# Altium project SmartWatch.PrjPcb (part 1 of 2)
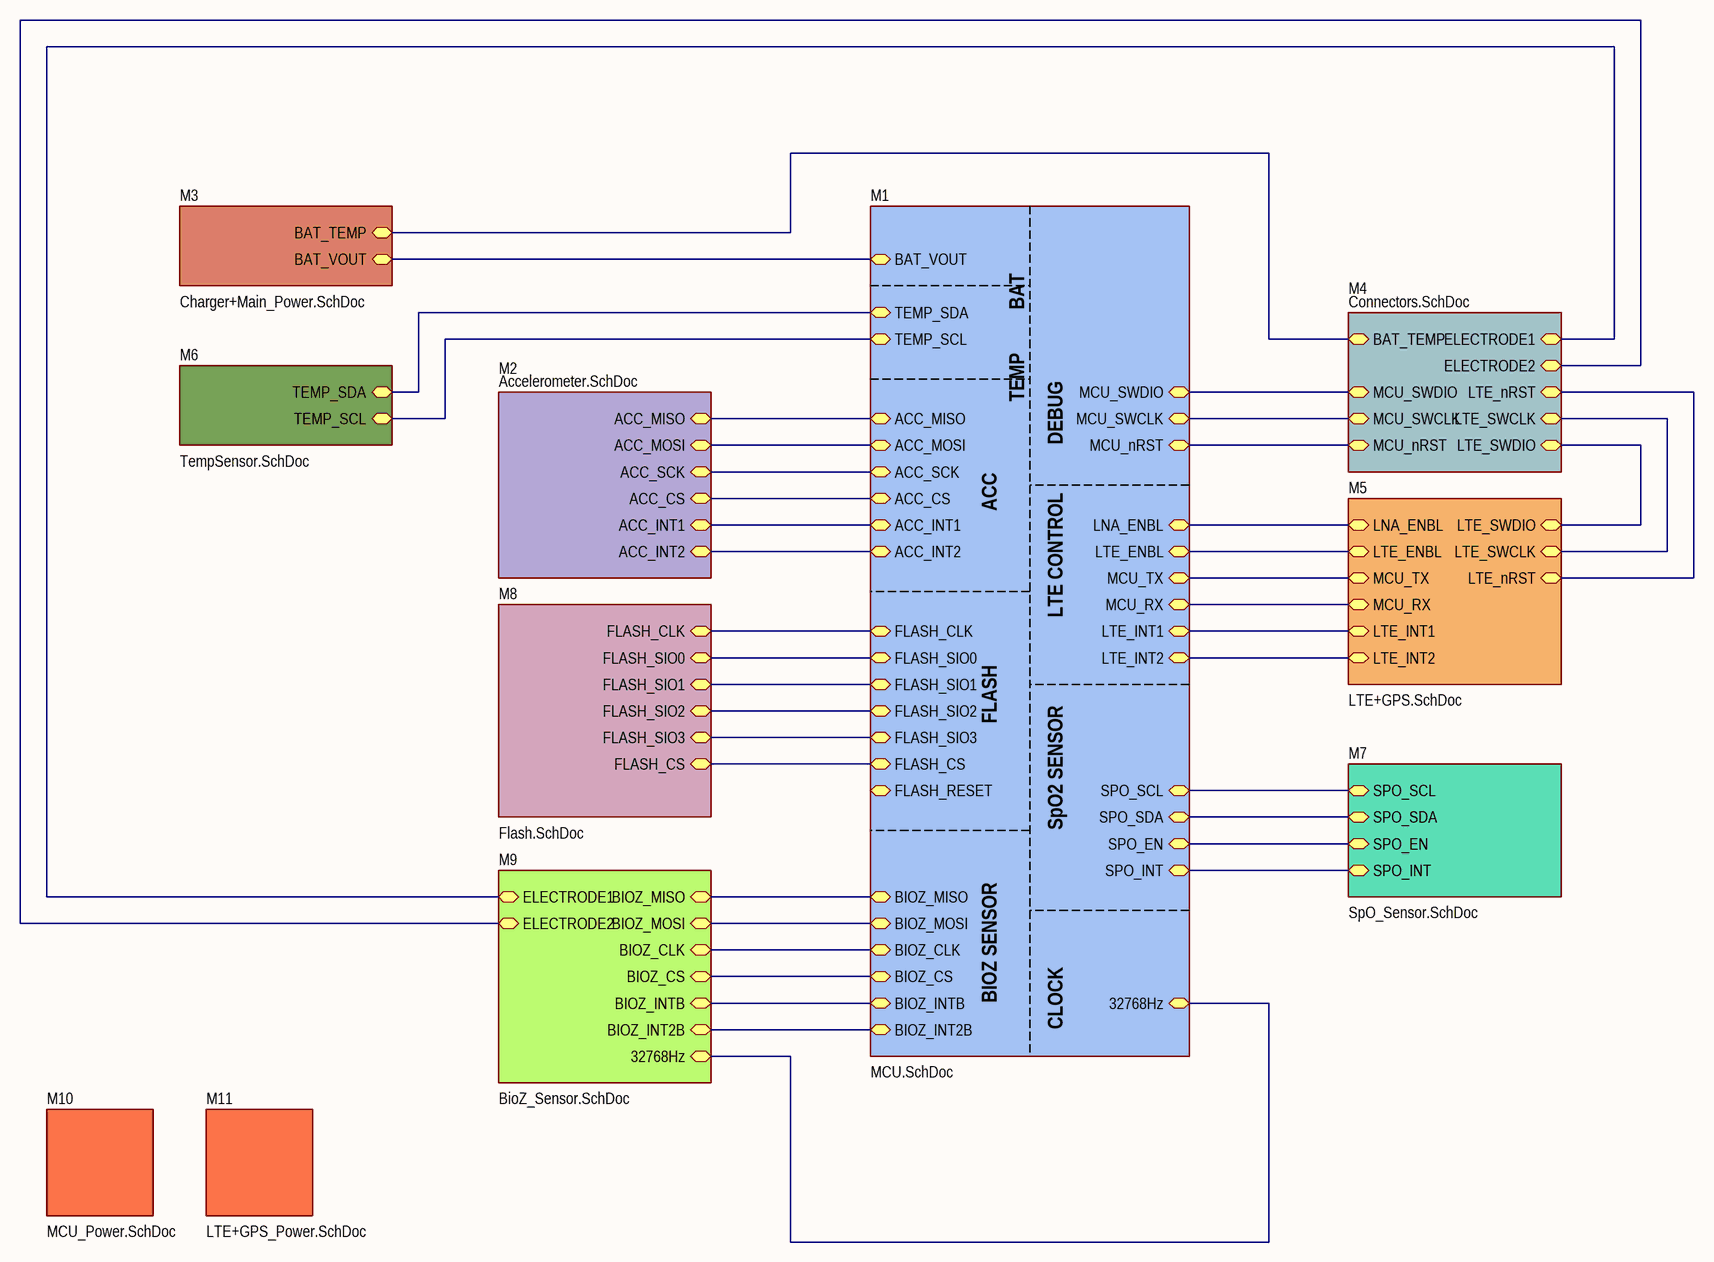
[diagram p0: Top_level.SchDoc]
12 sheets, 185 parts. Net scope: hierarchical (ports join the sheet entries above them; power ports are global).
Board file: SmartWatchPCB.PcbDoc
Sheets:
  Top_level.SchDoc
    M1 = MCU.SchDoc
    M2 = Accelerometer.SchDoc
    M3 = Charger+Main_Power.SchDoc
    M4 = Connectors.SchDoc
    M5 = LTE+GPS.SchDoc
    M8 = Flash.SchDoc
    M6 = TempSensor.SchDoc
    M7 = SpO_Sensor.SchDoc
    M9 = BioZ_Sensor.SchDoc
    M10 = MCU_Power.SchDoc
    M11 = LTE+GPS_Power.SchDoc

## Sheet Top_level.SchDoc
size 420 x 297 mm

### Sub-sheets
M1 = MCU.SchDoc: BAT_VOUT (bidir), TEMP_SDA (bidir), TEMP_SCL (bidir), ACC_INT2 (bidir), ACC_CS (bidir), LTE_ENBL (bidir), MCU_RX (bidir), ACC_MISO (bidir), ACC_MOSI (bidir), MCU_TX (bidir), MCU_nRST (bidir), MCU_SWCLK (bidir), MCU_SWDIO (bidir), ACC_INT1 (bidir), ACC_SCK (bidir), LNA_ENBL (bidir), FLASH_CS (bidir), FLASH_RESET (bidir), FLASH_SIO3 (bidir), FLASH_SIO0 (bidir), FLASH_CLK (bidir), FLASH_SIO2 (bidir), FLASH_SIO1 (bidir), 32768Hz (bidir), SPO_INT (bidir), SPO_EN (bidir), SPO_SCL (bidir), SPO_SDA (bidir), BIOZ_INT2B (bidir), BIOZ_INTB (bidir), BIOZ_MISO (bidir), BIOZ_CLK (bidir), BIOZ_MOSI (bidir), BIOZ_CS (bidir), LTE_INT1 (bidir), LTE_INT2 (bidir)
M2 = Accelerometer.SchDoc: ACC_MOSI (bidir), ACC_INT1 (bidir), ACC_CS (bidir), ACC_INT2 (bidir), ACC_SCK (bidir), ACC_MISO (bidir)
M3 = Charger+Main_Power.SchDoc: BAT_TEMP (bidir), BAT_VOUT (bidir)
M4 = Connectors.SchDoc: BAT_TEMP (bidir), MCU_SWDIO (bidir), MCU_nRST (bidir), MCU_SWCLK (bidir), ELECTRODE2 (bidir), ELECTRODE1 (bidir), LTE_SWDIO (bidir), LTE_nRST (bidir), LTE_SWCLK (bidir)
M5 = LTE+GPS.SchDoc: LNA_ENBL (bidir), LTE_ENBL (bidir), MCU_RX (bidir), MCU_TX (bidir), LTE_INT2 (bidir), LTE_INT1 (bidir), LTE_SWDIO (bidir), LTE_SWCLK (bidir), LTE_nRST (bidir)
M6 = TempSensor.SchDoc: TEMP_SCL (bidir), TEMP_SDA (bidir)
M7 = SpO_Sensor.SchDoc: SPO_SCL (bidir), SPO_INT (bidir), SPO_SDA (bidir), SPO_EN (bidir)
M8 = Flash.SchDoc: FLASH_CS (bidir), FLASH_SIO3 (bidir), FLASH_SIO0 (bidir), FLASH_CLK (bidir), FLASH_SIO2 (bidir), FLASH_SIO1 (bidir)
M9 = BioZ_Sensor.SchDoc: BIOZ_MISO (bidir), 32768Hz (bidir), BIOZ_CS (bidir), BIOZ_CLK (bidir), BIOZ_INTB (bidir), BIOZ_MOSI (bidir), ELECTRODE2 (bidir), ELECTRODE1 (bidir), BIOZ_INT2B (bidir)
M10 = MCU_Power.SchDoc: no entries
M11 = LTE+GPS_Power.SchDoc: no entries

### Nets
32768Hz: sheet M1/32768Hz, sheet M9/32768Hz
BAT_TS: sheet M3/BAT_TEMP, sheet M4/BAT_TEMP
NetC6_2: sheet M1/BAT_VOUT, sheet M3/BAT_VOUT
NetC11_2: sheet M1/MCU_nRST, sheet M4/MCU_nRST
NetC45_2: sheet M4/ELECTRODE1, sheet M9/ELECTRODE1
NetC52_2: sheet M4/ELECTRODE2, sheet M9/ELECTRODE2
NetD4_32: sheet M4/LTE_nRST, sheet M5/LTE_nRST
NetD4_33: sheet M4/LTE_SWCLK, sheet M5/LTE_SWCLK
NetD4_34: sheet M4/LTE_SWDIO, sheet M5/LTE_SWDIO
NetD7_A3: sheet M1/BIOZ_MISO, sheet M9/BIOZ_MISO
NetD7_B4: sheet M1/BIOZ_CLK, sheet M9/BIOZ_CLK
NetD7_B5: sheet M1/BIOZ_INT2B, sheet M9/BIOZ_INT2B
NetD7_C5: sheet M1/BIOZ_INTB, sheet M9/BIOZ_INTB
NetD7_C10: sheet M1/LTE_INT1, sheet M5/LTE_INT1
NetD7_D10: sheet M1/LTE_INT2, sheet M5/LTE_INT2
NetD7_E3: sheet M1/TEMP_SCL, sheet M6/TEMP_SCL
NetD7_E9: sheet M1/FLASH_CLK, sheet M8/FLASH_CLK
NetD7_E10: sheet M1/FLASH_SIO1, sheet M8/FLASH_SIO1
NetD7_F3: sheet M1/ACC_CS, sheet M2/ACC_CS
NetD7_F9: sheet M1/FLASH_SIO0, sheet M8/FLASH_SIO0
NetD7_F10: sheet M1/BIOZ_MOSI, sheet M9/BIOZ_MOSI
NetD7_G1: sheet M1/TEMP_SDA, sheet M6/TEMP_SDA
NetD7_G2: sheet M1/ACC_INT2, sheet M2/ACC_INT2
NetD7_G3: sheet M1/ACC_SCK, sheet M2/ACC_SCK
NetD7_G9: sheet M1/BIOZ_CS, sheet M9/BIOZ_CS
NetD7_G10: sheet M1/FLASH_SIO3, sheet M8/FLASH_SIO3
NetD7_H1: sheet M1/ACC_INT1, sheet M2/ACC_INT1
NetD7_H2: sheet M1/MCU_SWCLK, sheet M4/MCU_SWCLK
NetD7_H6: sheet M1/LTE_ENBL, sheet M5/LTE_ENBL
NetD7_H7: sheet M1/FLASH_CS, sheet M8/FLASH_CS
NetD7_H8: sheet M1/FLASH_SIO2, sheet M8/FLASH_SIO2
NetD7_J1: sheet M1/ACC_MOSI, sheet M2/ACC_MOSI
NetD7_J2: sheet M1/MCU_SWDIO, sheet M4/MCU_SWDIO
NetD7_J3: sheet M1/ACC_MISO, sheet M2/ACC_MISO
NetD7_J4: sheet M1/SPO_SCL, sheet M7/SPO_SCL
NetD7_J5: sheet M1/SPO_SDA, sheet M7/SPO_SDA
NetD7_J6: sheet M1/MCU_TX, sheet M5/MCU_TX
NetD7_K2: sheet M1/SPO_INT, sheet M7/SPO_INT
NetD7_K3: sheet M1/SPO_EN, sheet M7/SPO_EN
NetD7_K4: sheet M1/MCU_RX, sheet M5/MCU_RX
NetD7_K7: sheet M1/LNA_ENBL, sheet M5/LNA_ENBL

### Notes on the sheet
- BAT
- TEMP
- DEBUG
- ACC
- LTE CONTROL
- FLASH
- SpO2 SENSOR
- BIOZ SENSOR
- CLOCK
- Author
- Manufacturer
- Date
- Page
- Total pages
- Size page
- A3
- Materials

## Sheet MCU.SchDoc
size 420 x 297 mm
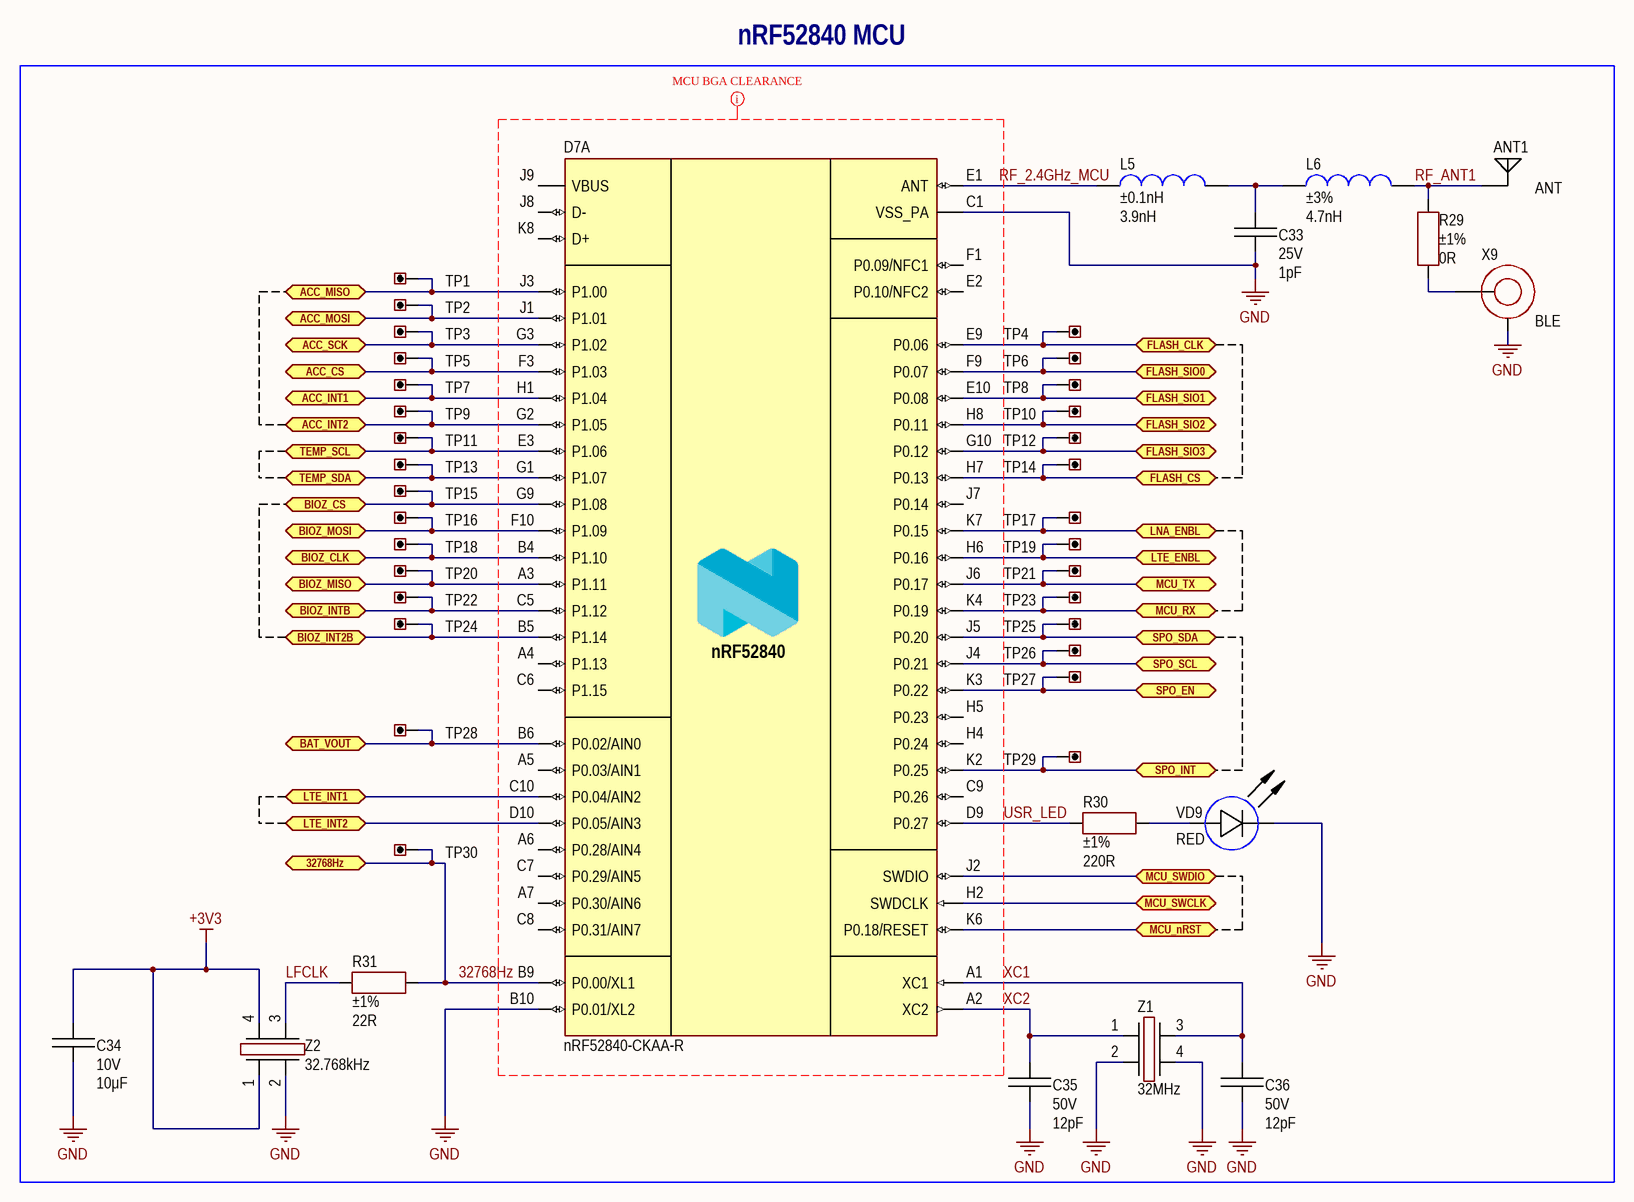
[diagram p1: MCU.SchDoc]

### Parts
ANT1  CommentText: ANT  [ANT: ANT2012LL00R2400A]
C33  value 1pF  Voltage: 25V  [CAP: 0201]
C34  value 10μF  Voltage: 10V  [CAP: 0805]
C35  value 12pF  Voltage: 50V  [CAP: 0805]
C36  value 12pF  Voltage: 50V  [CAP: 0805]
D7  PartNumber: nRF52840-CKAA-R  [MCU: nRF52840_WLCP93]  (part A of 2)
L5  value 3.9nH  Tolerance: ±0.1nH  [IND: 0201]
L6  value 4.7nH  Tolerance: ±3%  [IND: 0201]
R29  value 0R  Tolerance: ±1%  [RES: 0201]
R30  value 220R  Tolerance: ±1%  [RES: 0805]
R31  value 22R  Tolerance: ±1%  [RES: 0805]
TP1  (no value)  [CON: 5000 (Keystone)]
TP2  (no value)  [CON: 5000 (Keystone)]
TP3  (no value)  [CON: 5000 (Keystone)]
TP4  (no value)  [CON: 5000 (Keystone)]
TP5  (no value)  [CON: 5000 (Keystone)]
TP6  (no value)  [CON: 5000 (Keystone)]
TP7  (no value)  [CON: 5000 (Keystone)]
TP8  (no value)  [CON: 5000 (Keystone)]
TP9  (no value)  [CON: 5000 (Keystone)]
TP10  (no value)  [CON: 5000 (Keystone)]
TP11  (no value)  [CON: 5000 (Keystone)]
TP12  (no value)  [CON: 5000 (Keystone)]
TP13  (no value)  [CON: 5000 (Keystone)]
TP14  (no value)  [CON: 5000 (Keystone)]
TP15  (no value)  [CON: 5000 (Keystone)]
TP16  (no value)  [CON: 5000 (Keystone)]
TP17  (no value)  [CON: 5000 (Keystone)]
TP18  (no value)  [CON: 5000 (Keystone)]
TP19  (no value)  [CON: 5000 (Keystone)]
TP20  (no value)  [CON: 5000 (Keystone)]
TP21  (no value)  [CON: 5000 (Keystone)]
TP22  (no value)  [CON: 5000 (Keystone)]
TP23  (no value)  [CON: 5000 (Keystone)]
TP24  (no value)  [CON: 5000 (Keystone)]
TP25  (no value)  [CON: 5000 (Keystone)]
TP26  (no value)  [CON: 5000 (Keystone)]
TP27  (no value)  [CON: 5000 (Keystone)]
TP28  (no value)  [CON: 5000 (Keystone)]
TP29  (no value)  [CON: 5000 (Keystone)]
TP30  (no value)  [CON: 5000 (Keystone)]
VD9  Color: RED  [LED: 0805R]
X9  CommentText: BLE  [CON: u.Fl]
Z1  Frequency: 32MHz  [OSC: 2016]
Z2  Frequency: 32.768kHz  [OSC: 5032G]

### Blocks framed on the sheet
nRF52840 MCU: ANT1 C33-C36 D7 L5 L6 R29-R31 TP1-TP30 VD9 X9 Z1 Z2

### Ports
32768Hz (bidir), ACC_CS (bidir), ACC_INT1 (bidir), ACC_INT2 (bidir), ACC_MISO (bidir), ACC_MOSI (bidir), ACC_SCK (bidir), BAT_VOUT (bidir), BIOZ_CLK (bidir), BIOZ_CS (bidir), BIOZ_INT2B (bidir), BIOZ_INTB (bidir), BIOZ_MISO (bidir), BIOZ_MOSI (bidir), FLASH_CLK (bidir), FLASH_CS (bidir), FLASH_SIO0 (bidir), FLASH_SIO1 (bidir), FLASH_SIO2 (bidir), FLASH_SIO3 (bidir), LNA_ENBL (bidir), LTE_ENBL (bidir), LTE_INT1 (bidir), LTE_INT2 (bidir), MCU_nRST (bidir), MCU_RX (bidir), MCU_SWCLK (bidir), MCU_SWDIO (bidir), MCU_TX (bidir), SPO_EN (bidir), SPO_INT (bidir), SPO_SCL (bidir), SPO_SDA (bidir), TEMP_SCL (bidir), TEMP_SDA (bidir)

### Nets
+3V3: C34.2 Z2.1 Z2.4
GND: C33.1 C34.1 C35.1 C36.1 D7.B10(P0.01/XL2) D7.C1(VSS_PA) VD9.2(C) X9.2 Z1.2 Z1.4 Z2.2
32768Hz: D7.B9(P0.00/XL1) R31.1 TP30.1 ; port 32768Hz
LFCLK: R31.2 Z2.3
RF_2.4GHz_MCU: D7.E1(ANT) L5.2
RF_ANT1: ANT1.1 L6.1 R29.2
USR_LED: D7.D9(P0.27) R30.2
XC1: C36.2 D7.A1(XC1) Z1.3
XC2: C35.2 D7.A2(XC2) Z1.1
NetC6_2: D7.B6(P0.02/AIN0) TP28.1 ; port BAT_VOUT
NetC11_2: D7.K6(P0.18/RESET) ; port MCU_nRST
NetC33_2: C33.2 L5.1 L6.2
NetD7_A3: D7.A3(P1.11) TP20.1 ; port BIOZ_MISO
NetD7_B4: D7.B4(P1.10) TP18.1 ; port BIOZ_CLK
NetD7_B5: D7.B5(P1.14) TP24.1 ; port BIOZ_INT2B
NetD7_C5: D7.C5(P1.12) TP22.1 ; port BIOZ_INTB
NetD7_C10: D7.C10(P0.04/AIN2) ; port LTE_INT1
NetD7_D10: D7.D10(P0.05/AIN3) ; port LTE_INT2
NetD7_E3: D7.E3(P1.06) TP11.1 ; port TEMP_SCL
NetD7_E9: D7.E9(P0.06) TP4.1 ; port FLASH_CLK
NetD7_E10: D7.E10(P0.08) TP8.1 ; port FLASH_SIO1
NetD7_F3: D7.F3(P1.03) TP5.1 ; port ACC_CS
NetD7_F9: D7.F9(P0.07) TP6.1 ; port FLASH_SIO0
NetD7_F10: D7.F10(P1.09) TP16.1 ; port BIOZ_MOSI
NetD7_G1: D7.G1(P1.07) TP13.1 ; port TEMP_SDA
NetD7_G2: D7.G2(P1.05) TP9.1 ; port ACC_INT2
NetD7_G3: D7.G3(P1.02) TP3.1 ; port ACC_SCK
NetD7_G9: D7.G9(P1.08) TP15.1 ; port BIOZ_CS
NetD7_G10: D7.G10(P0.12) TP12.1 ; port FLASH_SIO3
NetD7_H1: D7.H1(P1.04) TP7.1 ; port ACC_INT1
NetD7_H2: D7.H2(SWDCLK) ; port MCU_SWCLK
NetD7_H6: D7.H6(P0.16) TP19.1 ; port LTE_ENBL
NetD7_H7: D7.H7(P0.13) TP14.1 ; port FLASH_CS
NetD7_H8: D7.H8(P0.11) TP10.1 ; port FLASH_SIO2
NetD7_J1: D7.J1(P1.01) TP2.1 ; port ACC_MOSI
NetD7_J2: D7.J2(SWDIO) ; port MCU_SWDIO
NetD7_J3: D7.J3(P1.00) TP1.1 ; port ACC_MISO
NetD7_J4: D7.J4(P0.21) TP26.1 ; port SPO_SCL
NetD7_J5: D7.J5(P0.20) TP25.1 ; port SPO_SDA
NetD7_J6: D7.J6(P0.17) TP21.1 ; port MCU_TX
NetD7_K2: D7.K2(P0.25) TP29.1 ; port SPO_INT
NetD7_K3: D7.K3(P0.22) TP27.1 ; port SPO_EN
NetD7_K4: D7.K4(P0.19) TP23.1 ; port MCU_RX
NetD7_K7: D7.K7(P0.15) TP17.1 ; port LNA_ENBL
NetR29_1: R29.1 X9.1
NetR30_1: R30.1 VD9.1(A)

Not connected (* = marked no-connect by the designer): D7 A4(P1.13) A5(P0.03/AIN1) A6(P0.28/AIN4) A7(P0.30/AIN6) C6(P1.15) C7(P0.29/AIN5) C8(P0.31/AIN7) C9(P0.26) E2(P0.10/NFC2) F1(P0.09/NFC1) H4(P0.24) H5(P0.23) J7(P0.14) J8(D-) J9(VBUS) K8(D+)

### Layout directives
net class MCU_BGA_CLEARANCE: RF_2.4GHz_MCU, USR_LED, XC1, XC2

### Notes on the sheet
- Author
- Manufacturer
- Date
- Page
- Total pages
- Size page
- A3
- Materials

### Library data of the parts
ANT1 = ANT2012LL00R2400A: 2.45GHz Bluetooth, ISM, Wi-Fi, Zigbee Chip RF Antenna 2.4GHz ~ 2.5GHz 3.77dBi Solder Surface Mount; Manufacturer: Yageo; ValueManufacturerPartNumber: Ceramic antenna, 2x1.25mm; HelpURL: https://www.digikey.com/en/products/detail/yageo/ANT2012LL00R2400A/9360375; Type: Ceramic antenna; PartNumber: ANT2012LL00R2400A; Package: 2x1.25mm
C33 = Ceramic_0201: 1 pF ±0.05pF 25V Ceramic Capacitor C0G, NP0 0201 (0603 Metric); Manufacturer: Murata Electronics; PartNumber: GJM0335C1E1R0WB01D; ValueManufacturerPartNumber: Ceramic capacitor, 1pF, NP0, ±0.05pF, 25V, 0201, -55...+125°C; Package: 0201; HelpURL: https://www.digikey.com/en/products/detail/murata-electronics/GJM0335C1E1R0WB01D/2592505; Temperature: -55...+125°C; TypeCapacitor: Ceramic capacitor; Tolerance: ±0.05pF; TypeDielectric: NP0
C34 = Ceramic_0805: 10 µF ±10% 10V Ceramic Capacitor X7R 0805 (2012 Metric); Manufacturer: Yageo; PartNumber: CC0805KFX7R6BB106; ValueManufacturerPartNumber: Ceramic capacitor, 10μF, X7R, ±10%, 10V, 0805, -55...+125°C; Package: 0805; HelpURL: https://www.digikey.com/en/products/detail/yageo/CC0805KFX7R6BB106/11611326; Temperature: -55...+125°C; TypeCapacitor: Ceramic capacitor; Tolerance: ±10%; TypeDielectric: X7R
C35 C36 = Ceramic_0805: 12 pF ±1% 50V Ceramic Capacitor C0G, NP0 0805 (2012 Metric); Manufacturer: Yageo; PartNumber: CC0805FRNPO9BN120; ValueManufacturerPartNumber: Ceramic capacitor, 12pF, NP0, ±10%, 50V, 0805, -55...+125°C; Tolerance: ±10%; Package: 0805; HelpURL: https://www.digikey.com/en/products/detail/yageo/CC0805FRNPO9BN120/5883925; Temperature: -55...+125°C; TypeCapacitor: Ceramic capacitor; TypeDielectric: NP0
D7 = nRF52840: MCU; Manufacturer: Nordic Semiconductor; CoreSize: 32bit; Speed: 64 MHz; MemoryROM: 1 MB; CoreProcessor: Cortex-M4; MemoryRAM: 256 kB; HelpURL: https://www.mouser.com/ProductDetail/Nordic-Semiconductor/nRF52840-CKAA-R?qs=PqoDHHvF64%2FDLCQsJ11t5w%3D%3D; ComponentType: IC microcontroller; Package: 93-WLCSP; ValueManufacturerPartNumber: =ComponentType+', '+CoreSize+', '+CoreProcessor+', '+Speed+', '+MemoryROM+', '+MemoryRAM+', '+Supply+', '+Temperature+', '+Package
L5 = Inductor_0201: 3.9 nH Unshielded Thick Film Inductor 400 mA 300mOhm Max 0201 (0603 Metric); Manufacturer: Murata Electronics; PartNumber: LQP03TN3N9B02D; ValueManufacturerPartNumber: Fixed inductor, 3.9nH, ±0.1nH, 0201, 400mA, -55...+125°C; TypeInductor: Fixed inductor; MaxCurrent: 400mA; Package: 0201; HelpURL: https://www.digikey.com/en/products/detail/murata-electronics/LQP03TN3N9B02D/2391748; Temperature: -55...+125°C
L6 = Inductor_0201: 4.7 nH Unshielded Thick Film Inductor 350 mA 400mOhm Max 0201 (0603 Metric); Manufacturer: Murata Electronics; PartNumber: LQP03TN4N7H02D; ValueManufacturerPartNumber: Fixed inductor, 4.7nH, ±3%, 0201, 350mA, -55...+125°C; TypeInductor: Fixed inductor; MaxCurrent: 350mA; Package: 0201; HelpURL: https://www.digikey.com/en/products/detail/murata-electronics/LQP03TN4N7H02D/4358101; Temperature: -55...+125°C
R29 = Resistor_0201: 0 Ohms Jumper 0.05W, 1/20W Chip Resistor 0201 (0603 Metric) Moisture Resistant Thick Film; Manufacturer: Yageo; PartNumber: RC0201FR-070RL; ValueManufacturerPartNumber: Resistor film, 0R, ±1%, 0201, 0.05W, -55...+125°C; TypeResistor: Resistor film; Package: 0201; HelpURL: https://www.digikey.com/en/products/detail/yageo/RC0201FR-070RL/1948858; Temperature: -55...+125°C; Power: 0.05W
R30 = Resistor_0805: 22 Ohms ±1% 0.125W, 1/8W Chip Resistor 0805 (2012 Metric) Moisture Resistant Thick Film; Manufacturer: Yageo; PartNumber: RC0805JR-07220RL; ValueManufacturerPartNumber: Resistor film, 220R, ±1%, 0805, 0.125W, -55...+125°C; TypeResistor: Resistor film; Package: 0805; HelpURL: https://www.digikey.com/en/products/detail/yageo/RC0805JR-07220RL/728283; Temperature: -55...+125°C; Power: 0.125W
R31 = Resistor_0805: 22 Ohms ±1% 0.125W, 1/8W Chip Resistor 0805 (2012 Metric) Moisture Resistant Thick Film; Manufacturer: Yageo; PartNumber: RC0805FR-0722RL; ValueManufacturerPartNumber: Resistor film, 22R, ±1%, 0805, 0.125W, -55...+125°C; TypeResistor: Resistor film; Package: 0805; HelpURL: https://www.digikey.com/en/products/detail/yageo/RC0805FR-0722RL/727735; Temperature: -55...+125°C; Power: 0.125W
TP1-TP30 = Connector_Test_Point: Red PC Test Point, Miniature Phosphor Bronze Silver Plating 0.040" (1.02mm) Hole Diameter Mounting Type; Manufacturer: Keystone; ValueManufacturerPartNumber: Test point, Keystone, 5000; PartNumber: 5000; HelpURL: https://www.digikey.com/en/products/detail/keystone-electronics/5000/255326; TypeConnector: Test point
VD9 = LED_single: Red 625nm LED Indication - Discrete 1.8V 0805 (2012 Metric); Manufacturer: Kingbright; ValueManufacturerPartNumber: LED, RED, 30mA, 1.8V, 0805, -55...+150°C; PartNumber: APT2012LSECK/J3-PRV; Current: 30mA; Package: 0805; HelpURL: https://www.digikey.com/en/products/detail/kingbright/APT2012LSECK-J3-PRV/5177436; Temperature: -55...+150°C; TypeDiode: LED; VoltageDrop: 1.8V; ColorParameter: RED
X9 = Connector_uFL: U.FL (UMCC) Connector Receptacle, Male Pin 50Ohm Surface Mount Solder; Manufacturer: Hirose Electric; ValueManufacturerPartNumber: Connector u.FL, 50 Ohm, 6GHz; PartNumber: U.FL-R-SMT(01); TypeConnector: Connector u.FL; Frequency: 6GHz; HelpURL: https://www.digikey.com/product-detail/en/hirose-electric-co-ltd/U.FL-R-SMT-01/H9161-ND/513010; Impedance: 50 Ohm
Z1 = Crystal_2016: 32 MHz ±10ppm Crystal 8pF 60 Ohms 4-SMD, No Lead; Manufacturer: EPSON; PartNumber: FA-128 32.0000MF10Z-AJ3; ValueManufacturerPartNumber: Crystal, 32MHz, 8pF, ±50ppm, case 2016, -30...+85°C; Tolerance: ±50ppm; Package: case 2016; HelpURL: https://www.digikey.com/en/products/detail/epson/FA-128-32-0000MF10Z-AJ3/5259651; Temperature: -30...+85°C; TypeOscilator: Crystal; LoadCapacitance: 8pF
Z2 = Oscilator_5032: 32.768 kHz XO (Standard) LVCMOS Oscillator 1.8V Enable/Disable 4-SMD, No Lead; Manufacturer: Abracon LLC; PartNumber: KD3270037; ValueManufacturerPartNumber: Oscilator, 32.768kHz, HCMOS, ±50ppm, case 5032, -20...+70°C; LoadCapacitance: HCMOS; Tolerance: ±50ppm; Package: case 5032; HelpURL: https://www.digikey.com/en/products/detail/diodes-incorporated/KD3270037/2833169; Temperature: -20...+70°C; TypeOscilator: Oscilator

## Sheet Accelerometer.SchDoc
size 420 x 297 mm
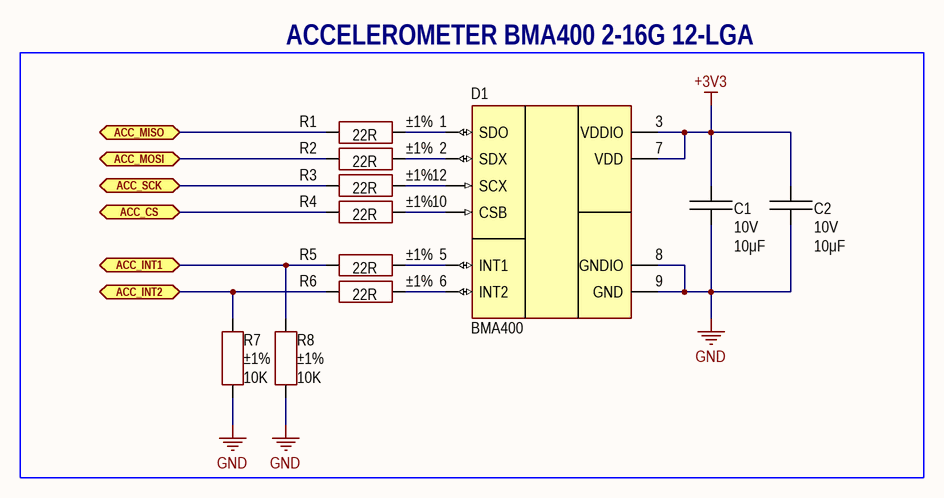
[diagram p2: Accelerometer.SchDoc]

### Parts
C1  value 10μF  Voltage: 10V  [CAP: 0805]
C2  value 10μF  Voltage: 10V  [CAP: 0805]
D1  (no value)  [12-VFLGA]
R1  value 22R  Tolerance: ±1%  [RES: 0805]
R2  value 22R  Tolerance: ±1%  [RES: 0805]
R3  value 22R  Tolerance: ±1%  [RES: 0805]
R4  value 22R  Tolerance: ±1%  [RES: 0805]
R5  value 22R  Tolerance: ±1%  [RES: 0805]
R6  value 22R  Tolerance: ±1%  [RES: 0805]
R7  value 10K  Tolerance: ±1%  [RES: 0805]
R8  value 10K  Tolerance: ±1%  [RES: 0805]

### Blocks framed on the sheet
ACCELEROMETER BMA400 2-16G 12-LGA: C1 C2 D1 R1-R8

### Ports
ACC_CS (bidir), ACC_INT1 (bidir), ACC_INT2 (bidir), ACC_MISO (bidir), ACC_MOSI (bidir), ACC_SCK (bidir)

### Nets
+3V3: C1.2 C2.2 D1.3(VDDIO) D1.7(VDD)
GND: C1.1 C2.1 D1.8(GNDIO) D1.9(GND) R7.1 R8.1
NetD1_1: D1.1(SDO) R1.2
NetD1_2: D1.2(SDX) R2.2
NetD1_5: D1.5(INT1) R5.2
NetD1_6: D1.6(INT2) R6.2
NetD1_10: D1.10(CSB) R4.2
NetD1_12: D1.12(SCX) R3.2
NetD7_F3: R4.1 ; port ACC_CS
NetD7_G2: R6.1 R7.2 ; port ACC_INT2
NetD7_G3: R3.1 ; port ACC_SCK
NetD7_H1: R5.1 R8.2 ; port ACC_INT1
NetD7_J1: R2.1 ; port ACC_MOSI
NetD7_J3: R1.1 ; port ACC_MISO

### Notes on the sheet
- Author
- Manufacturer
- Date
- Page
- Total pages
- Size page
- A3
- Materials

### Library data of the parts
C1 C2 = Ceramic_0805: as C34 on sheet MCU; Package: 0805; HelpURL: https://www.digikey.com/en/products/detail/yageo/CC0805KFX7R6BB106/11611326; Temperature: -55...+125°C; TypeCapacitor: Ceramic capacitor; Tolerance: ±10%; TypeDielectric: X7R
D1 = BMA400: Accelerometer; Manufacturer: Bosch Sensortec; Supply: 1.72...3.6V; Sensing: Digital sensor; HelpURL: https://www.digikey.com/en/products/detail/bosch-sensortec/BMA400/8634941; Package: 12-VFLGA; ComponentType: IC accelerometer; ValueManufacturerPartNumber: =ComponentType+', '+Sensing+', '+Accuracy+', '+GainBandwidth+', '+Sensitivity+', '+Temperature+', '+Package; Temperature: -40...+85°C; PartNumber: BMA400
R1-R6 = Resistor_0805: as R31 on sheet MCU; Package: 0805; HelpURL: https://www.digikey.com/en/products/detail/yageo/RC0805FR-0722RL/727735; Temperature: -55...+125°C; Power: 0.125W
R7 R8 = Resistor_0805: 10 kOhms ±1% 0.125W, 1/8W Chip Resistor 0805 (2012 Metric) Moisture Resistant Thick Film; Manufacturer: Yageo; PartNumber: RC0805FR-0710KL; ValueManufacturerPartNumber: Resistor film, 10K, ±1%, 0805, 0.125W, -55...+125°C; TypeResistor: Resistor film; Package: 0805; HelpURL: https://www.digikey.com/en/products/detail/yageo/RC0805FR-0710KL/727535; Temperature: -55...+125°C; Power: 0.125W

## Sheet Charger+Main_Power.SchDoc
size 420 x 297 mm
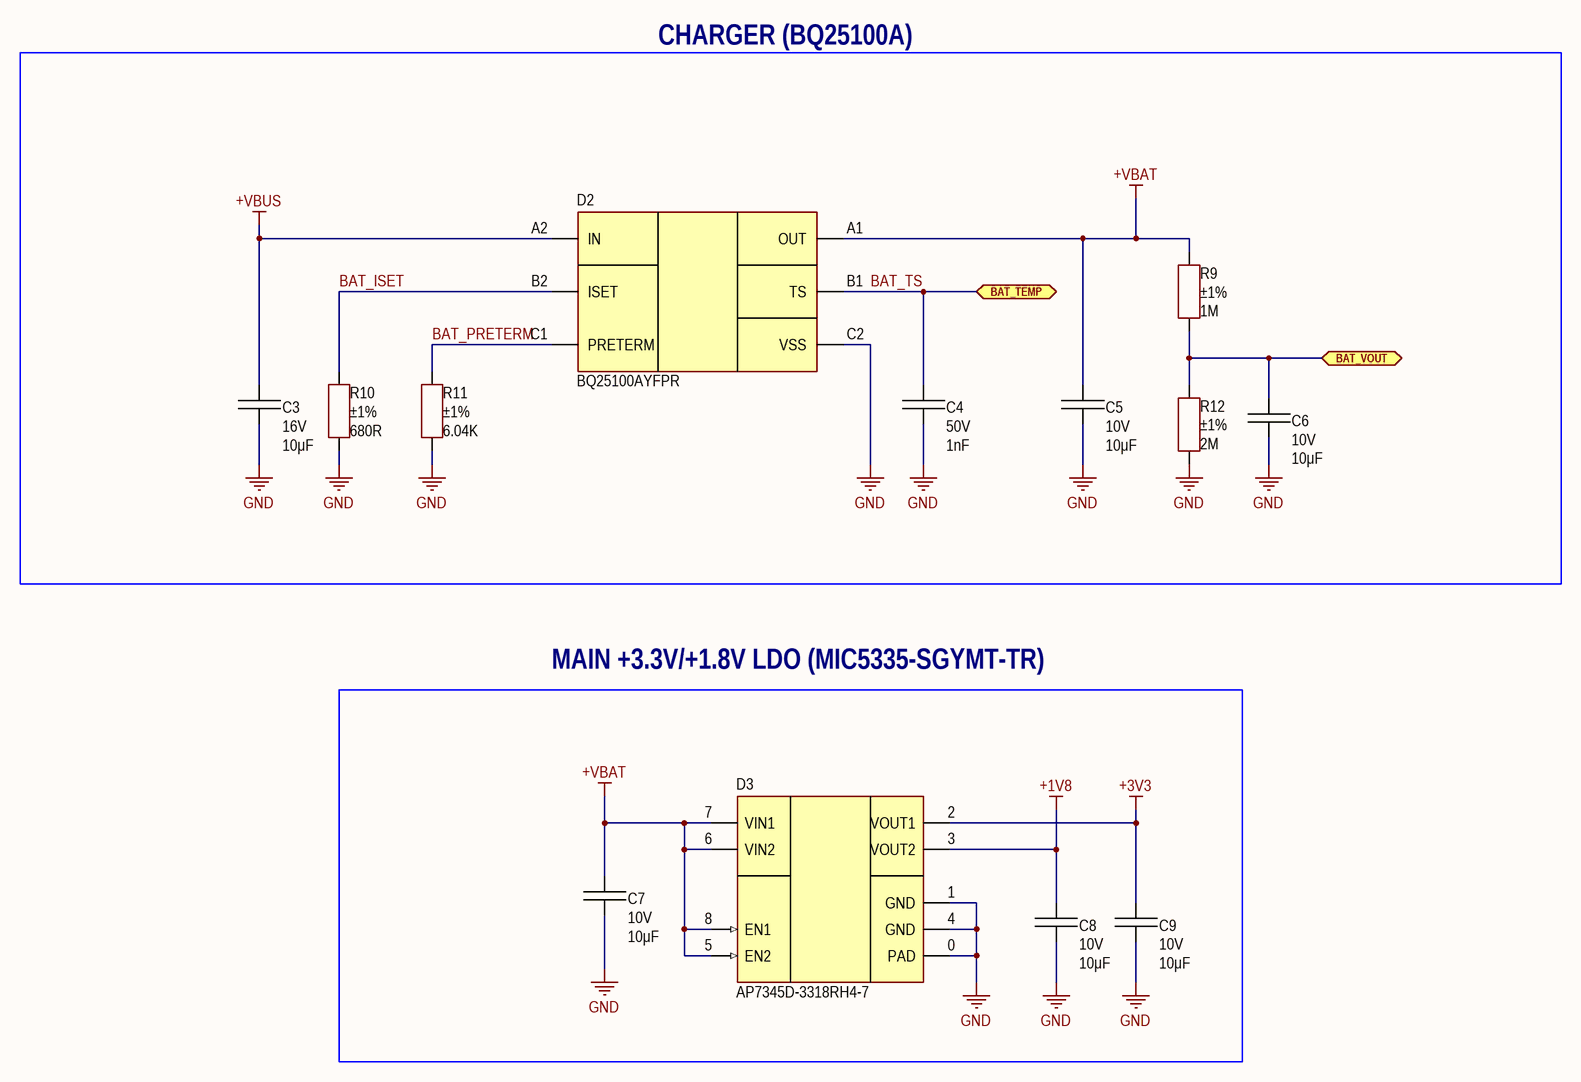
[diagram p3: Charger+Main_Power.SchDoc]

### Parts
C3  value 10μF  Voltage: 16V  [CAP: 0805]
C4  value 1nF  Voltage: 50V  [CAP: 0805]
C5  value 10μF  Voltage: 10V  [CAP: 0805]
C6  value 10μF  Voltage: 10V  [CAP: 0805]
C7  value 10μF  Voltage: 10V  [CAP: 0805]
C8  value 10μF  Voltage: 10V  [CAP: 0805]
C9  value 10μF  Voltage: 10V  [CAP: 0805]
D2  (no value)  [IC: BQ25100]
D3  (no value)  [IC: 8-XFDFN]
R9  value 1M  Tolerance: ±1%  [RES: 0805]
R10  value 680R  Tolerance: ±1%  [RES: 0805]
R11  value 6.04K  Tolerance: ±1%  [RES: 0805]
R12  value 2M  Tolerance: ±1%  [RES: 0805]

### Blocks framed on the sheet
CHARGER (BQ25100A): C3-C6 D2 R9-R12
MAIN +3.3V/+1.8V LDO (MIC5335-SGYMT-TR): C7-C9 D3

### Ports
BAT_TEMP (bidir), BAT_VOUT (bidir)

### Nets
+1V8: C8.2 D3.3(VOUT2)
+3V3: C9.2 D3.2(VOUT1)
+VBAT: C5.2 C7.2 D2.A1(OUT) D3.5(EN2) D3.6(VIN2) D3.7(VIN1) D3.8(EN1) R9.1
+VBUS: C3.2 D2.A2(IN)
GND: C3.1 C4.1 C5.1 C6.1 C7.1 C8.1 C9.1 D2.C2(VSS) D3.0(PAD) D3.1(GND) D3.4(GND) R10.2 R11.2 R12.2
BAT_ISET: D2.B2(ISET) R10.1
BAT_PRETERM: D2.C1(PRETERM) R11.1
BAT_TS: C4.2 D2.B1(TS) ; port BAT_TEMP
NetC6_2: C6.2 R9.2 R12.1 ; port BAT_VOUT

### Notes on the sheet
- Author
- Manufacturer
- Date
- Page
- Total pages
- Size page
- A3
- Materials

### Library data of the parts
C3 = Ceramic_0805: 10 µF ±20% 16V Ceramic Capacitor X7R 0805 (2012 Metric); Manufacturer: Yageo; PartNumber: CC0805MKX7R7BB106; ValueManufacturerPartNumber: Ceramic capacitor, 10μF, X7R, ±10%, 16V, 0805, -55...+125°C; Tolerance: ±10%; Package: 0805; HelpURL: https://www.digikey.com/en/products/detail/yageo/CC0805MKX7R7BB106/7164392; Temperature: -55...+125°C; TypeCapacitor: Ceramic capacitor; TypeDielectric: X7R
C4 = Ceramic_0805: 1000 pF ±5% 50V Ceramic Capacitor C0G, NP0 0805 (2012 Metric); Manufacturer: Yageo; PartNumber: CC0805JRNPO9BN102; ValueManufacturerPartNumber: Ceramic capacitor, 1nF, NP0, ±5%, 50V, 0805, -55...+125°C; Package: 0805; HelpURL: https://www.digikey.com/en/products/detail/yageo/CC0805JRNPO9BN102/302856; Temperature: -55...+125°C; TypeCapacitor: Ceramic capacitor; Tolerance: ±5%; TypeDielectric: NP0
C5-C9 = Ceramic_0805: as C34 on sheet MCU; Package: 0805; HelpURL: https://www.digikey.com/en/products/detail/yageo/CC0805KFX7R6BB106/11611326; Temperature: -55...+125°C; TypeCapacitor: Ceramic capacitor; Tolerance: ±10%; TypeDielectric: X7R
D2 = BQ25100AYFPR: PMIC; Manufacturer: Texas Instruments; ValueManufacturerPartNumber: PMIC, Li-Ion/Li-Po, 4.45...6.45V, -40...+85°C, 10-WSON; Supply: 4.45...6.45V; HelpURL: https://www.digikey.com/en/products/detail/texas-instruments/BQ25100AYFPR/4977096; Package: 10-WSON; ComponentType: PMIC; Temperature: -40...+85°C; Standard: Li-Ion/Li-Po; PartNumber: BQ25100AYFPR
D3 = AP7345D-3318RH4-7: Linear voltage regulator; Manufacturer: Diodes Incorporated; ValueManufacturerPartNumber: Linear voltage regulator, input 3.6...5.25V, 0.39V, 3.3V/1.8V, 0.3A, -40...+125°C, 8-XFDFN; VoltageInput: input 3.6...5.25V; MaxDropout: 0.39V; CurrentOutput: 0.3A; VoltageOutput: 3.3V/1.8V; HelpURL: https://www.digikey.com/en/products/detail/diodes-incorporated/AP7345D-3318RH4-7/9857637; Package: 8-XFDFN; ComponentType: Linear voltage regulator; Temperature: -40...+125°C; PartNumber: AP7345D-3318RH4-7
R9 = Resistor_0805: 1 MOhms ±1% 0.125W, 1/8W Chip Resistor 0805 (2012 Metric) Moisture Resistant Thick Film; Manufacturer: Yageo; PartNumber: RC0805FR-071ML; ValueManufacturerPartNumber: Resistor film, 1M, ±1%, 0805, 0.125W, -55...+125°C; TypeResistor: Resistor film; Package: 0805; HelpURL: https://www.digikey.com/en/products/detail/yageo/RC0805FR-071ML/727445; Temperature: -55...+125°C; Power: 0.125W
R10 = Resistor_0805: 680 Ohms ±1% 0.125W, 1/8W Chip Resistor 0805 (2012 Metric) Moisture Resistant Thick Film; Manufacturer: Yageo; PartNumber: RC0805FR-07680RL; ValueManufacturerPartNumber: Resistor film, 680R, ±1%, 0805, 0.125W, -55...+125°C; TypeResistor: Resistor film; Package: 0805; HelpURL: https://www.digikey.com/en/products/detail/yageo/RC0805FR-07680RL/728101; Temperature: -55...+125°C; Power: 0.125W
R11 = Resistor_0805: 6.04 kOhms ±1% 0.125W, 1/8W Chip Resistor 0805 (2012 Metric) Moisture Resistant Thick Film; Manufacturer: Yageo; PartNumber: RC0805FR-076K04L; ValueManufacturerPartNumber: Resistor film, 6.04K, ±1%, 0805, 0.125W, -55...+125°C; TypeResistor: Resistor film; Package: 0805; HelpURL: https://www.digikey.com/en/products/detail/yageo/RC0805FR-076K04L/728049; Temperature: -55...+125°C; Power: 0.125W
R12 = Resistor_0805: 2 MOhms ±1% 0.125W, 1/8W Chip Resistor 0805 (2012 Metric) Moisture Resistant Thick Film; Manufacturer: Yageo; PartNumber: RC0805FR-072ML; ValueManufacturerPartNumber: Resistor film, 2M, ±1%, 0805, 0.125W, -55...+125°C; TypeResistor: Resistor film; Package: 0805; HelpURL: https://www.digikey.com/en/products/detail/yageo/RC0805FR-072ML/727665; Temperature: -55...+125°C; Power: 0.125W

## Sheet Connectors.SchDoc
size 420 x 297 mm
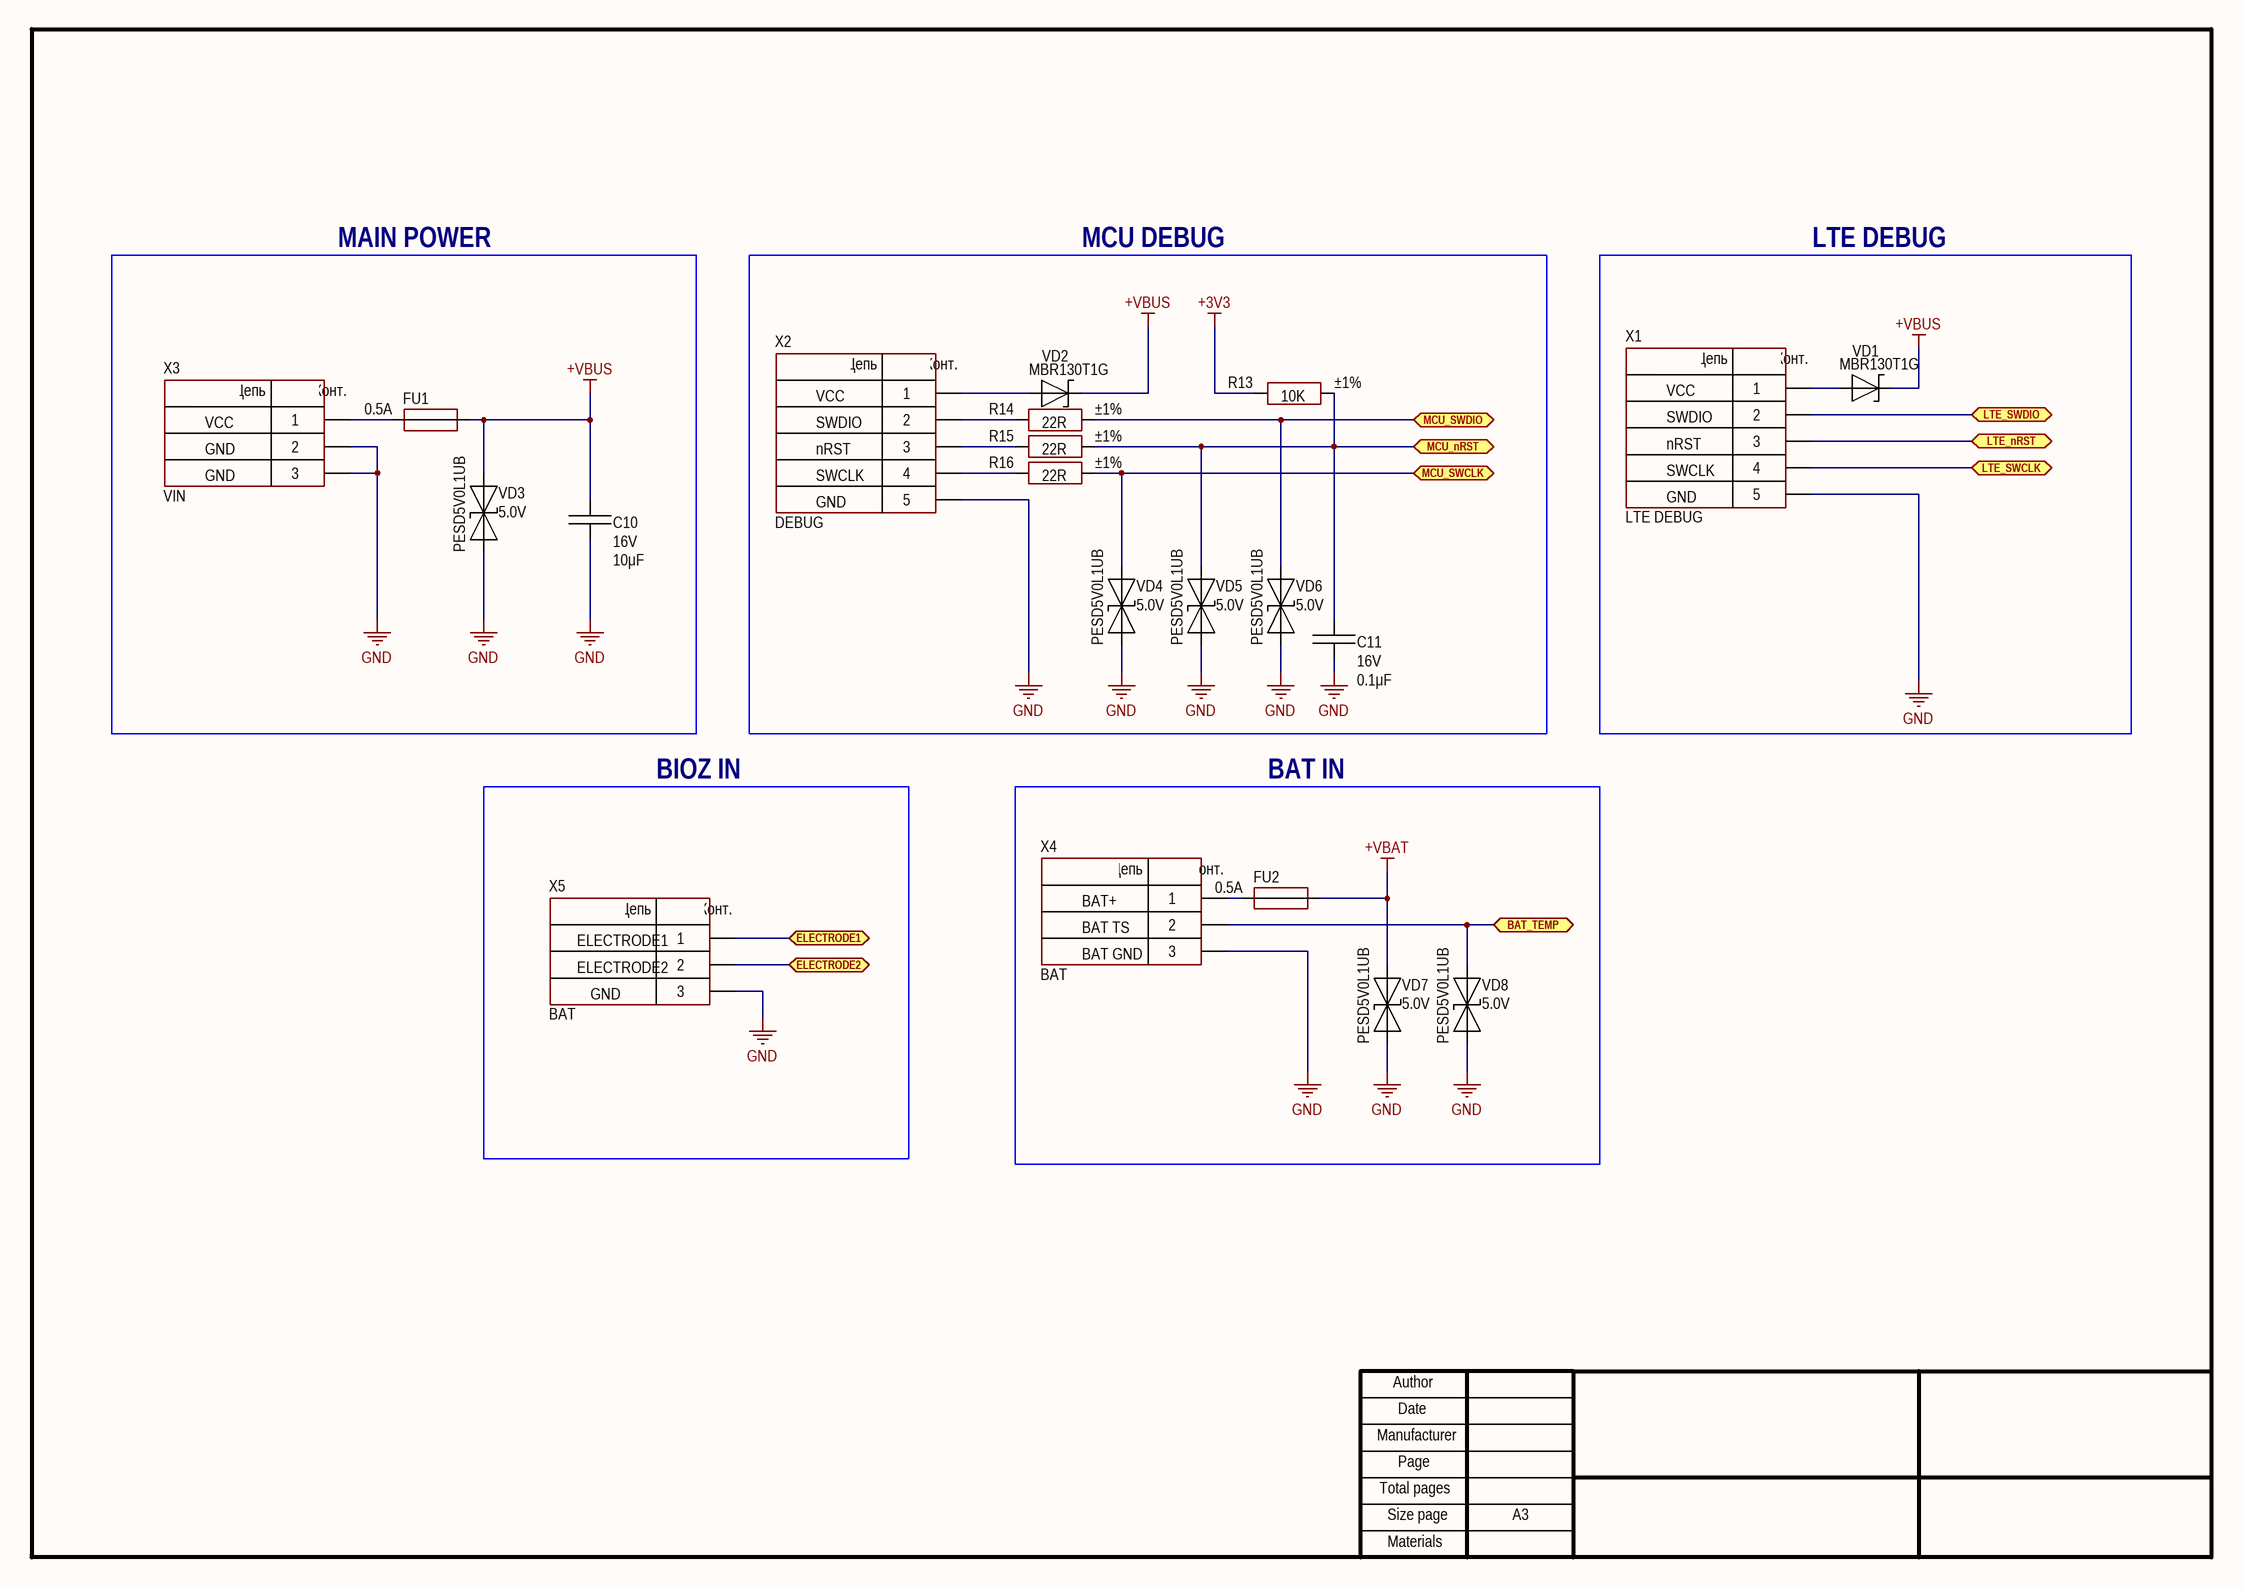
[diagram p4: Connectors.SchDoc]

### Parts
C10  value 10μF  Voltage: 16V  [CAP: 0805]
C11  value 0.1μF  Voltage: 16V  [CAP: 0805]
FU1  MaxCurrent: 0.5A  [FUSE: 1206]
FU2  MaxCurrent: 0.5A  [FUSE: 1206]
R13  value 10K  Tolerance: ±1%  [RES: 0805]
R14  value 22R  Tolerance: ±1%  [RES: 0805]
R15  value 22R  Tolerance: ±1%  [RES: 0805]
R16  value 22R  Tolerance: ±1%  [RES: 0805]
VD1  PartNumber: MBR130T1G  [DIODE: SOD123]
VD2  PartNumber: MBR130T1G  [DIODE: SOD123]
VD3  Voltage: 5.0V  PartNumber: PESD5V0L1UB  [DIODE: SOD523]
VD4  Voltage: 5.0V  PartNumber: PESD5V0L1UB  [DIODE: SOD523]
VD5  Voltage: 5.0V  PartNumber: PESD5V0L1UB  [DIODE: SOD523]
VD6  Voltage: 5.0V  PartNumber: PESD5V0L1UB  [DIODE: SOD523]
VD7  Voltage: 5.0V  PartNumber: PESD5V0L1UB  [DIODE: SOD523]
VD8  Voltage: 5.0V  PartNumber: PESD5V0L1UB  [DIODE: SOD523]
X1  CommentText: LTE DEBUG  [CON: PLS-5]
X2  CommentText: DEBUG  [CON: PLS-5]
X3  CommentText: VIN  [CON: DG350-3.5-03P]
X4  CommentText: BAT  [CON: DG350-3.5-03P]
X5  CommentText: BAT  [CON: DG350-3.5-03P]

### Blocks framed on the sheet
MAIN POWER: C10 FU1 VD3 X3
MCU DEBUG: C11 R13-R16 VD2 VD4-VD6 X2
LTE DEBUG: VD1 X1
BIOZ IN: X5
BAT IN: FU2 VD7 VD8 X4

### Ports
BAT_TEMP (bidir), ELECTRODE1 (bidir), ELECTRODE2 (bidir), LTE_nRST (bidir), LTE_SWCLK (bidir), LTE_SWDIO (bidir), MCU_nRST (bidir), MCU_SWCLK (bidir), MCU_SWDIO (bidir)

### Nets
+3V3: R13.1
+VBAT: FU2.2 VD7.2(C)
+VBUS: C10.2 FU1.2 VD1.2 VD2.2 VD3.2(C)
GND: C10.1 C11.1 VD3.1(A) VD4.1(A) VD5.1(A) VD6.1(A) VD7.1(A) VD8.1(A) X1.5 X2.5 X3.2 X3.3 X4.3 X5.3
BAT_TS: VD8.2(C) X4.2 ; port BAT_TEMP
NetC11_2: C11.2 R13.2 R15.2 VD5.2(C) ; port MCU_nRST
NetC45_2: X5.1 ; port ELECTRODE1
NetC52_2: X5.2 ; port ELECTRODE2
NetD4_32: X1.3 ; port LTE_nRST
NetD4_33: X1.4 ; port LTE_SWCLK
NetD4_34: X1.2 ; port LTE_SWDIO
NetD7_H2: R16.2 VD4.2(C) ; port MCU_SWCLK
NetD7_J2: R14.2 VD6.2(C) ; port MCU_SWDIO
NetFU1_1: FU1.1 X3.1
NetFU2_1: FU2.1 X4.1
NetR14_1: R14.1 X2.2
NetR15_1: R15.1 X2.3
NetR16_1: R16.1 X2.4
NetVD1_1: VD1.1 X1.1
NetVD2_1: VD2.1 X2.1

### Notes on the sheet
- VCC
- GND
- nRST
- SWDIO
- SWCLK
- BAT+
- BAT TS
- (near X5) ELECTRODE1
- (near X5) ELECTRODE2
- BAT GND
- Author
- Manufacturer
- Date
- Page
- Total pages
- Size page
- A3
- Materials
- (in symbol Connector_terminal_3pin) Цепь; Конт.
- (in symbol PLS-5) Цепь; Конт.

### Library data of the parts
C10 = Ceramic_0805: as C3 on sheet Charger+Main_Power; Package: 0805; HelpURL: https://www.digikey.com/en/products/detail/yageo/CC0805MKX7R7BB106/7164392; Temperature: -55...+125°C; TypeCapacitor: Ceramic capacitor; TypeDielectric: X7R
C11 = Ceramic_0805: Manufacturer: Yageo; PartNumber: CC0805KRX7R7BB104; ValueManufacturerPartNumber: Ceramic capacitor, 0.1μF, X7R, ±10%, 16V, 0805, -55...+125°C; TypeCapacitor: Ceramic capacitor; Tolerance: ±10%; TypeDielectric: X7R; Package: 0805; HelpURL: https://www.digikey.com/product-detail/en/yageo/CC0805KRX7R7BB104/311-1142-1-ND/303052; Temperature: -55...+125°C
FU1 FU2 = Fuse: Polymeric PTC Resettable Fuse 6V 500 mA Ih Surface Mount 0805 (2012 Metric), Concave; Manufacturer: Bel Fuse; PartNumber: 0ZCK0050FF2E; TypeFuse: Electromechanics relay; VoltageMax: 250VAC; Package: 1206; HelpURL: https://www.digikey.com/en/products/detail/bel-fuse-inc/0ZCK0050FF2E/4156141; ValueManufacturerPartNumber: =TypeFuse+', '+VoltageMax+', '+MaxCurrent+', '+Package+', '+Temperature
R13 = Resistor_0805: as R7 on sheet Accelerometer; Package: 0805; HelpURL: https://www.digikey.com/en/products/detail/yageo/RC0805FR-0710KL/727535; Temperature: -55...+125°C; Power: 0.125W
R14-R16 = Resistor_0805: as R31 on sheet MCU; Package: 0805; HelpURL: https://www.digikey.com/en/products/detail/yageo/RC0805FR-0722RL/727735; Temperature: -55...+125°C; Power: 0.125W
VD1 VD2 = Schottky_single: Diode Schottky 30 V 1A Surface Mount SOD-123; Manufacturer: Diodes Incorporated; ValueManufacturerPartNumber: Schottky diode, 30V, 1A, 0.45V, 15pF, SOD-123, -55...+150°C; TypeDiode: Schottky diode; Voltage: 30V; VoltageDrop: 0.45V; RecoveryTime: 15pF; Package: SOD-123; HelpURL: https://www.digikey.com/en/products/detail/on-semiconductor/MBR130T1G/918582; Temperature: -55...+150°C; Current: 1A
VD3-VD8 = TVS_single: 12V Clamp 3.5A (8/20µs) Ipp Tvs Diode Surface Mount SOD-523; Manufacturer: Nexperia; TypeDiode: ESD TVS diode; Package: SOD-523; HelpURL: https://www.digikey.com/en/products/detail/nexperia-usa-inc/PESD5V0L1UB115/2092297; ValueManufacturerPartNumber: =TypeDiode+', '+Voltage+', '+Current+', '+VoltageDrop+', '+RecoveryTime+', '+Package+', '+Temperature; Temperature: -55...+150°C; Current: 3.5A
X1 = PLS-5: Manufacturer: Connfly; ValueManufacturerPartNumber: Connector, 5pin, 2.54mm, 500VAC, 3A; TypeConnector: Connector; VoltageMax: 500VAC; Pitch: 2.54mm; CurrentMax: 3A; Multichannel: 5pin; HelpURL: https://www.chipdip.ru/product/pls-5; PartNumber: PLS-5
X2 = PLS-5: Connector Header Through Hole 5 position 0.100" (2.54mm); Manufacturer: Würth Elektronik; ValueManufacturerPartNumber: Connector, 5pin, 2.54mm, 500VAC, 3A; PartNumber: 61300511121; VoltageMax: 500VAC; CurrentMax: 3A; Multichannel: 5pin; HelpURL: https://www.digikey.com/en/products/detail/w%C3%BCrth-elektronik/61300511121/4846831; TypeConnector: Connector; Pitch: 2.54mm
X3-X5 = Connector_terminal_3pin: 3 Position Wire to Board Terminal Block Horizontal with Board 0.138" (3.50mm) Through Hole; Manufacturer: TE Connectivity; ValueManufacturerPartNumber: Terminal connector, 3pin, 3.5mm, 300VAC, 12A; PartNumber: 1546551-3; TypeConnector: Terminal connector; VoltageMax: 300VAC; Pitch: 3.5mm; CurrentMax: 12A; Multichannel: 3pin; HelpURL: https://www.digikey.com/en/products/detail/te-connectivity-amp-connectors/1546551-3/2221615

## Sheet LTE+GPS.SchDoc
size 420 x 297 mm
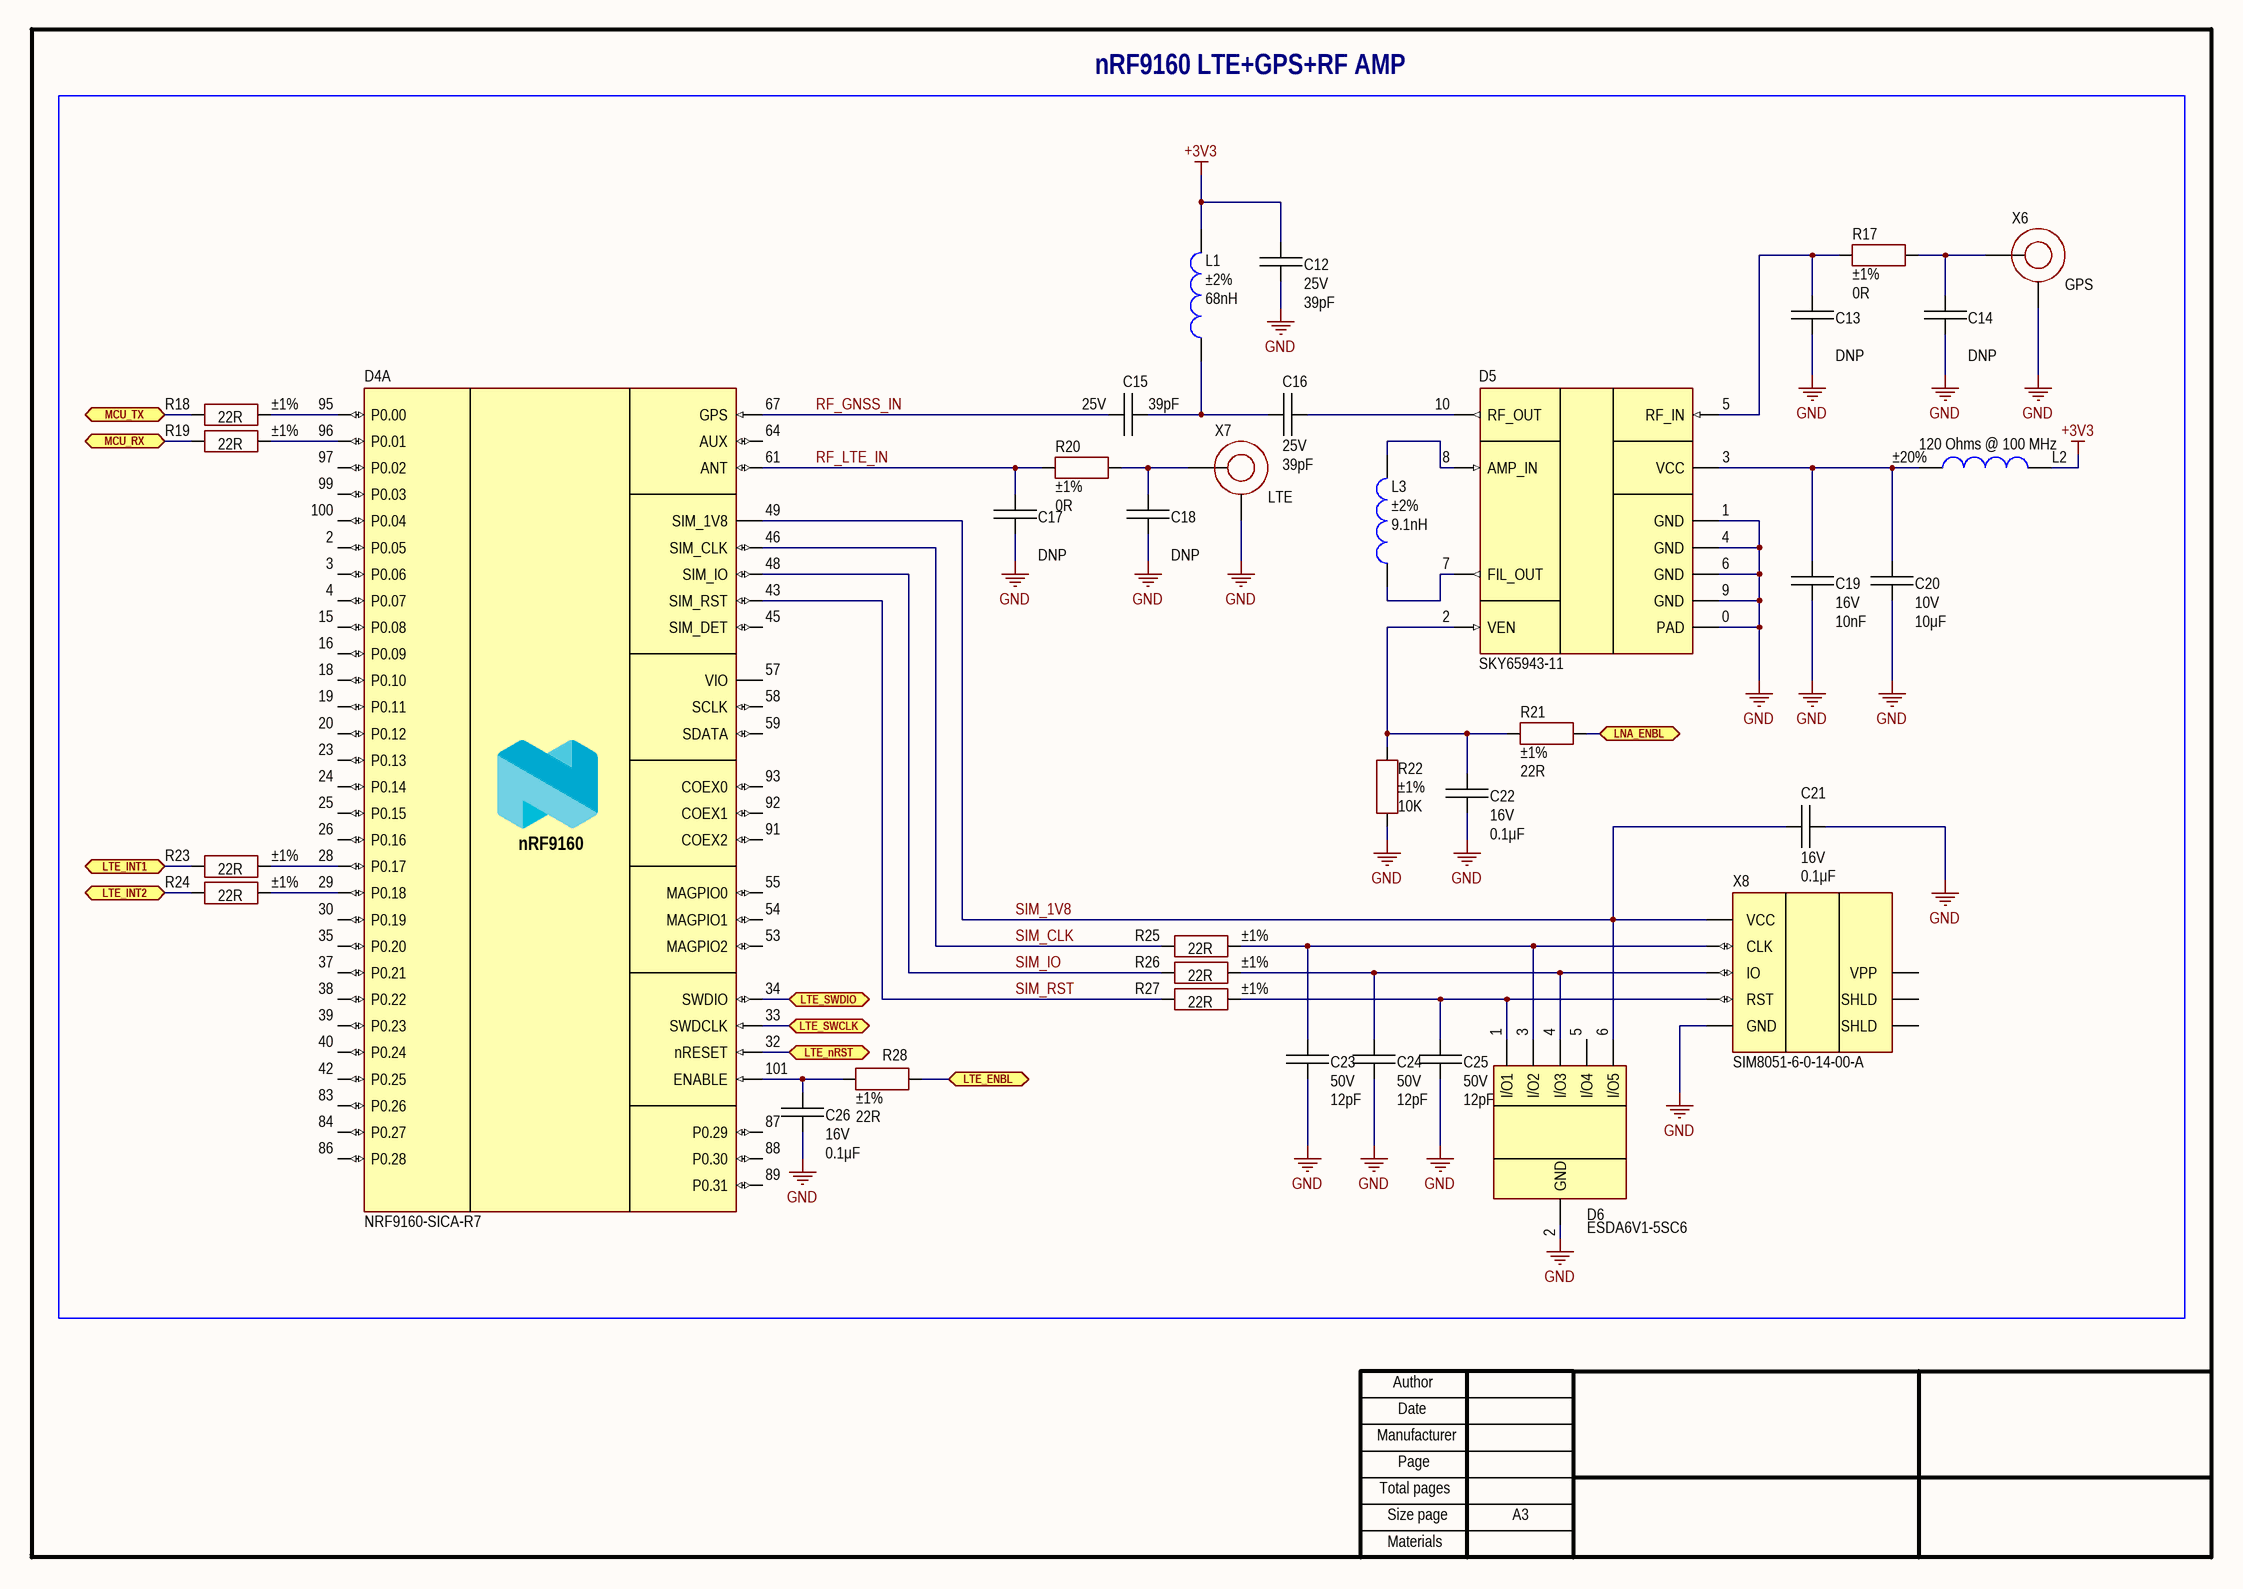
[diagram p5: LTE+GPS.SchDoc]

### Parts
C12  value 39pF  Voltage: 25V  [CAP: 0201]
C13  value DNP  [CAP: 0201]
C14  value DNP  [CAP: 0201]
C15  value 39pF  Voltage: 25V  [CAP: 0201]
C16  value 39pF  Voltage: 25V  [CAP: 0201]
C17  value DNP  [CAP: 0201]
C18  value DNP  [CAP: 0201]
C19  value 10nF  Voltage: 16V  [CAP: 0402_NO_SILK]
C20  value 10μF  Voltage: 10V  [CAP: 0805]
C21  value 0.1μF  Voltage: 16V  [CAP: 0402_NO_SILK]
C22  value 0.1μF  Voltage: 16V  [CAP: 0805]
C23  value 12pF  Voltage: 50V  [CAP: 0805]
C24  value 12pF  Voltage: 50V  [CAP: 0805]
C25  value 12pF  Voltage: 50V  [CAP: 0805]
C26  value 0.1μF  Voltage: 16V  [CAP: 0805]
D4  PartNumber: NRF9160-SICA-R7  [MOD: NRF9160]  (part A of 3)
D5  (no value)  [IC: SKY65943-11]
D6  (no value)  [SOT23-6]
L1  value 68nH  Tolerance: ±2%  [IND: 0402]
L2  value 120 Ohms @ 100 MHz  Tolerance: ±20%  [IND: 0805]
L3  value 9.1nH  Tolerance: ±2%  [IND: 0402]
R17  value 0R  Tolerance: ±1%  [RES: 0201]
R18  value 22R  Tolerance: ±1%  [RES: 0805]
R19  value 22R  Tolerance: ±1%  [RES: 0805]
R20  value 0R  Tolerance: ±1%  [RES: 0201]
R21  value 22R  Tolerance: ±1%  [RES: 0805]
R22  value 10K  Tolerance: ±1%  [RES: 0805]
R23  value 22R  Tolerance: ±1%  [RES: 0805]
R24  value 22R  Tolerance: ±1%  [RES: 0805]
R25  value 22R  Tolerance: ±1%  [RES: 0805]
R26  value 22R  Tolerance: ±1%  [RES: 0805]
R27  value 22R  Tolerance: ±1%  [RES: 0805]
R28  value 22R  Tolerance: ±1%  [RES: 0805]
X6  CommentText: GPS  [CON: u.Fl]
X7  CommentText: LTE  [CON: u.Fl]
X8  (no value)  [CON: SIM8051-6-0-14-00]

### Blocks framed on the sheet
nRF9160 LTE+GPS+RF AMP: C12-C26 D4-D6 L1-L3 R17-R28 X6-X8

### Ports
LNA_ENBL (bidir), LTE_ENBL (bidir), LTE_INT1 (bidir), LTE_INT2 (bidir), LTE_nRST (bidir), LTE_SWCLK (bidir), LTE_SWDIO (bidir), MCU_RX (bidir), MCU_TX (bidir)

### Nets
+3V3: C12.1 L1.1 L2.1
GND: C12.2 C13.1 C14.1 C17.1 C18.1 C19.1 C20.1 C21.2 C22.1 C23.1 C24.1 C25.1 C26.1 D5.0(PAD) D5.1(GND) D5.4(GND) D5.6(GND) D5.9(GND) D6.2(GND) R22.1 X6.2 X7.2 X8.C5(GND)
RF_GNSS_IN: C15.2 D4.67(GPS)
RF_LTE_IN: C17.2 D4.61(ANT) R20.2
SIM_1V8: C21.1 D4.49(SIM_1V8) D6.6(I/O5) X8.C1(VCC)
SIM_CLK: D4.46(SIM_CLK) R25.1
SIM_IO: D4.48(SIM_IO) R26.1
SIM_RST: D4.43(SIM_RST) R27.1
NetC13_2: C13.2 D5.5(RF_IN) R17.2
NetC14_2: C14.2 R17.1 X6.1
NetC15_1: C15.1 C16.2 L1.2
NetC16_1: C16.1 D5.10(RF_OUT)
NetC18_2: C18.2 R20.1 X7.1
NetC19_2: C19.2 C20.2 D5.3(VCC) L2.2
NetC22_2: C22.2 D5.2(VEN) R21.2 R22.2
NetC23_2: C23.2 D6.3(I/O2) R25.2 X8.C3(CLK)
NetC24_2: C24.2 D6.4(I/O3) R26.2 X8.C7(IO)
NetC25_2: C25.2 D6.1(I/O1) R27.2 X8.C2(RST)
NetC26_2: C26.2 D4.101(ENABLE) R28.2
NetD4_28: D4.28(P0.17) R23.2
NetD4_29: D4.29(P0.18) R24.2
NetD4_32: D4.32(nRESET) ; port LTE_nRST
NetD4_33: D4.33(SWDCLK) ; port LTE_SWCLK
NetD4_34: D4.34(SWDIO) ; port LTE_SWDIO
NetD4_95: D4.95(P0.00) R18.2
NetD4_96: D4.96(P0.01) R19.2
NetD5_7: D5.7(FIL_OUT) L3.2
NetD5_8: D5.8(AMP_IN) L3.1
NetD7_C10: R23.1 ; port LTE_INT1
NetD7_D10: R24.1 ; port LTE_INT2
NetD7_H6: R28.1 ; port LTE_ENBL
NetD7_J6: R18.1 ; port MCU_TX
NetD7_K4: R19.1 ; port MCU_RX
NetD7_K7: R21.1 ; port LNA_ENBL

Not connected (* = marked no-connect by the designer): D4 2(P0.05) 3(P0.06) 4(P0.07) 15(P0.08) 16(P0.09) 18(P0.10) 19(P0.11) 20(P0.12) 23(P0.13) 24(P0.14) 25(P0.15) 26(P0.16) 30(P0.19) 35(P0.20) 37(P0.21) 38(P0.22) 39(P0.23) 40(P0.24) 42(P0.25) 45(SIM_DET) 53(MAGPIO2) 54(MAGPIO1) 55(MAGPIO0) 57(VIO) 58(SCLK) 59(SDATA) 64(AUX) 83(P0.26) 84(P0.27) 86(P0.28) 87(P0.29) 88(P0.30) 89(P0.31) 91(COEX2) 92(COEX1) 93(COEX0) 97(P0.02) 99(P0.03) 100(P0.04); D6 5(I/O4); X8 C4(SHLD) C6(VPP) C8(SHLD)

### Notes on the sheet
- Author
- Manufacturer
- Date
- Page
- Total pages
- Size page
- A3
- Materials

### Library data of the parts
C12 C15 C16 = Ceramic_0201: 39 pF ±5% 25V Ceramic Capacitor C0G, NP0 0201 (0603 Metric); Manufacturer: Murata Electronics; PartNumber: GRM0335C1E390JA01D; ValueManufacturerPartNumber: Ceramic capacitor, 39pF, NP0, ±5%, 25V, 0201, -55...+125°C; Package: 0201; HelpURL: https://www.digikey.com/en/products/detail/murata-electronics/GRM0335C1E390JA01D/4358216; Temperature: -55...+125°C; TypeCapacitor: Ceramic capacitor; Tolerance: ±5%; TypeDielectric: NP0
C13 C14 C17 C18 = Ceramic_0201: DNP; ValueManufacturerPartNumber: Ceramic capacitor, DNP, , , , 0201, -55...+125°C; TypeCapacitor: Ceramic capacitor; Package: 0201; Temperature: -55...+125°C
C19 = Ceramic_0402: 0.1 µF ±10% 16V Ceramic Capacitor X7R 0402 (1005 Metric); Manufacturer: Yageo; PartNumber: CC0805JKNPO7BN103; ValueManufacturerPartNumber: Ceramic capacitor, 10nF, X7R, ±10%, 16V, 0402, -55...+125°C; Package: 0402; HelpURL: https://www.digikey.com/en/products/detail/yageo/CC0805JKNPO7BN103/5884010; Temperature: -55...+125°C; TypeCapacitor: Ceramic capacitor; Tolerance: ±10%; TypeDielectric: X7R
C20 = Ceramic_0805: as C34 on sheet MCU; Package: 0805; HelpURL: https://www.digikey.com/en/products/detail/yageo/CC0805KFX7R6BB106/11611326; Temperature: -55...+125°C; TypeCapacitor: Ceramic capacitor; Tolerance: ±10%; TypeDielectric: X7R
C21 = Ceramic_0402: 0.1 µF ±10% 16V Ceramic Capacitor X7R 0402 (1005 Metric); Manufacturer: Yageo; PartNumber: CC0402KRX7R7BB104; ValueManufacturerPartNumber: Ceramic capacitor, 0.1μF, X7R, ±10%, 16V, 0402, -55...+125°C; Package: 0402; HelpURL: https://www.digikey.com/product-detail/en/yageo/CC0402KRX7R7BB104/311-1338-1-ND/2103122; Temperature: -55...+125°C; TypeCapacitor: Ceramic capacitor; Tolerance: ±10%; TypeDielectric: X7R
C22 C26 = Ceramic_0805: as C11 on sheet Connectors; Package: 0805; HelpURL: https://www.digikey.com/product-detail/en/yageo/CC0805KRX7R7BB104/311-1142-1-ND/303052; Temperature: -55...+125°C
C23-C25 = Ceramic_0805: as C35 on sheet MCU; Package: 0805; HelpURL: https://www.digikey.com/en/products/detail/yageo/CC0805FRNPO9BN120/5883925; Temperature: -55...+125°C; TypeCapacitor: Ceramic capacitor; TypeDielectric: NP0
D4 = nRF9160: LTE/GSM module; Manufacturer: Nordic Semiconductor; Supply: 3...5.5V; Frequency: 2.4GHz; TypeProtocol: LTE-M/NB-IoT/GPS; HelpURL: https://www.digikey.com/en/products/detail/nordic-semiconductor-asa/NRF9160-SICA-R7/10242085; Package: 127-LGA; ComponentType: LTE/GSM module; ValueManufacturerPartNumber: =ComponentType+', '+TypeProtocol+', '+Frequency+', '+CoreSize+', '+CoreProcessor+', '+MemoryROM+', '+MemoryRAM+', '+Supply+', '+Temperature+', '+Package; Temperature: -40...+85°C
D5 = SKY65943-11: RF front-end; Manufacturer: Skyworks Solutions; ValueManufacturerPartNumber: IC RF amplifier, 2.7 GHz, 19dB, -40...+125°C, 10-SMD Module; Gain: 19dB; Frequency: 2.7 GHz; HelpURL: https://www.digikey.com/en/products/detail/skyworks-solutions-inc/SKY65943-11/9603434; Package: 10-SMD Module; ComponentType: IC RF amplifier; Temperature: -40...+125°C; PartNumber: SKY65943-11
D6 = ESDA6V1-5SC6: TVS Array; Manufacturer: STMicroelectronics; Current: 5A peak; VoltageDrop: 6.1V; Package: SOT-23-6; HelpURL: https://www.digikey.com/en/products/detail/stmicroelectronics/ESDA6V1-5SC6/1037983; ValueManufacturerPartNumber: =TypeDiode+', '+Voltage+', '+Current+', '+VoltageDrop+', '+RecoveryTime+', '+Package+', '+Temperature; Temperature: -40...+125°C; TypeDiode: TVS array; PartNumber: ESDA6V1-5SC6
L1 = Inductor_0402: 68 nH Unshielded Wirewound Inductor 320 mA 1.1Ohm Max 0402 (1005 Metric); Manufacturer: Murata Electronics; PartNumber: LQW15AN68NG80D; ValueManufacturerPartNumber: Fixed inductor, 68nH, ±2%, 0402, 0.32A, -55...+125°C; TypeInductor: Fixed inductor; MaxCurrent: 0.32A; Package: 0402; HelpURL: https://www.digikey.com/en/products/detail/murata-electronics/LQW15AN68NG80D/4864887; Temperature: -55...+125°C
L2 = Inductor_0805: 120 Ohms @ 100 MHz 1 Power Line Ferrite Bead 0805 (2012 Metric) 3A 30mOhm; Manufacturer: Murata Electronics; PartNumber: BLM21PG121SH1D; ValueManufacturerPartNumber: Fixed inductor, 120 Ohms @ 100 MHz, ±20%, 0805, 3A, -55...+125°C; TypeInductor: Fixed inductor; Package: 0805; HelpURL: https://www.digikey.com/en/products/detail/murata-electronics/BLM21PG121SH1D/4419690; Temperature: -55...+125°C; MaxCurrent: 3A
L3 = Inductor_0402: 9.1 nH Unshielded Wirewound Inductor 1.4 A 80mOhm Max 0402 (1005 Metric); Manufacturer: Murata Electronics; PartNumber: LQW15AN9N1G8ZD; ValueManufacturerPartNumber: Fixed inductor, 9.1nH, ±2%, 0402, 1.4A, -55...+125°C; TypeInductor: Fixed inductor; MaxCurrent: 1.4A; Package: 0402; HelpURL: https://www.digikey.com/en/products/detail/murata-electronics/LQW15AN9N1G8ZD/6799034; Temperature: -55...+125°C
R17 R20 = Resistor_0201: as R29 on sheet MCU; Package: 0201; HelpURL: https://www.digikey.com/en/products/detail/yageo/RC0201FR-070RL/1948858; Temperature: -55...+125°C; Power: 0.05W
R18 R19 R21 R23-R28 = Resistor_0805: as R31 on sheet MCU; Package: 0805; HelpURL: https://www.digikey.com/en/products/detail/yageo/RC0805FR-0722RL/727735; Temperature: -55...+125°C; Power: 0.125W
R22 = Resistor_0805: as R7 on sheet Accelerometer; Package: 0805; HelpURL: https://www.digikey.com/en/products/detail/yageo/RC0805FR-0710KL/727535; Temperature: -55...+125°C; Power: 0.125W
X6 X7 = Connector_uFL: as X9 on sheet MCU; HelpURL: https://www.digikey.com/product-detail/en/hirose-electric-co-ltd/U.FL-R-SMT-01/H9161-ND/513010; Impedance: 50 Ohm
X8 = SIM8051-6-0-14-00-A: Connector; Manufacturer: GCT; TypeConnector: Nano SIM; HelpURL: https://www.digikey.com/en/products/detail/gct/SIM8051-6-0-14-00-A/10649873; ValueManufacturerPartNumber: =TypeConnector+', '+Multichannel+', '+Pitch+', '+VoltageMax+', '+CurrentMax; PartNumber: SIM8051-6-0-14-00-A; CommentText: SIM8051-6-0-14-00-A

## Sheet Flash.SchDoc
size 420 x 297 mm
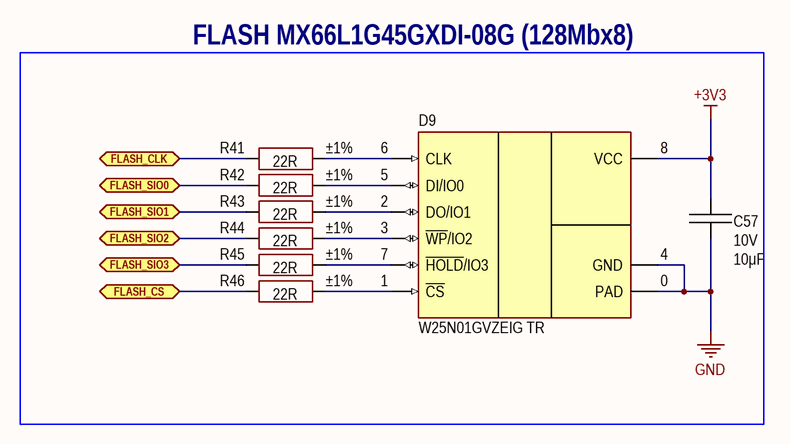
[diagram p6: Flash.SchDoc]

### Parts
C57  value 10μF  Voltage: 10V  [CAP: 0805]
D9  (no value)  [IC: 8-WSON]
R41  value 22R  Tolerance: ±1%  [RES: 0805]
R42  value 22R  Tolerance: ±1%  [RES: 0805]
R43  value 22R  Tolerance: ±1%  [RES: 0805]
R44  value 22R  Tolerance: ±1%  [RES: 0805]
R45  value 22R  Tolerance: ±1%  [RES: 0805]
R46  value 22R  Tolerance: ±1%  [RES: 0805]

### Blocks framed on the sheet
FLASH MX66L1G45GXDI-08G (128Mbx8): C57 D9 R41-R46

### Ports
FLASH_CLK (bidir), FLASH_CS (bidir), FLASH_SIO0 (bidir), FLASH_SIO1 (bidir), FLASH_SIO2 (bidir), FLASH_SIO3 (bidir)

### Nets
+3V3: C57.2 D9.8(VCC)
GND: C57.1 D9.0(PAD) D9.4(GND)
NetD7_E9: R41.1 ; port FLASH_CLK
NetD7_E10: R43.1 ; port FLASH_SIO1
NetD7_F9: R42.1 ; port FLASH_SIO0
NetD7_G10: R45.1 ; port FLASH_SIO3
NetD7_H7: R46.1 ; port FLASH_CS
NetD7_H8: R44.1 ; port FLASH_SIO2
NetD9_1: D9.1(~{CS}) R46.2
NetD9_2: D9.2(DO/IO1) R43.2
NetD9_3: D9.3(~{WP}/IO2) R44.2
NetD9_5: D9.5(DI/IO0) R42.2
NetD9_6: D9.6(CLK) R41.2
NetD9_7: D9.7(~{HOLD}/IO3) R45.2

### Notes on the sheet
- Author
- Manufacturer
- Date
- Page
- Total pages
- Size page
- A3
- Materials

### Library data of the parts
C57 = Ceramic_0805: as C34 on sheet MCU; Package: 0805; HelpURL: https://www.digikey.com/en/products/detail/yageo/CC0805KFX7R6BB106/11611326; Temperature: -55...+125°C; TypeCapacitor: Ceramic capacitor; Tolerance: ±10%; TypeDielectric: X7R
D9 = W25N01GVZEIG TR: FLASH; Manufacturer: Winbond Electronics; ValueManufacturerPartNumber: IC memory, FLASH, 1gb (128M x 8), 133 MHz, SPI/QuadSPI, 2.7...3.6V, -40...+85°C, 8-WDFN; Supply: 2.7...3.6V; Speed: 133 MHz; InterfaceData: SPI/QuadSPI; MemorySize: 1gb (128M x 8); HelpURL: https://www.digikey.com/en/products/detail/winbond-electronics/W25N01GVZEIG-TR/5803931; Package: 8-WDFN; ComponentType: IC memory; Temperature: -40...+85°C; MemoryType: FLASH; PartNumber: W25N01GVZEIG TR
R41-R46 = Resistor_0805: as R31 on sheet MCU; Package: 0805; HelpURL: https://www.digikey.com/en/products/detail/yageo/RC0805FR-0722RL/727735; Temperature: -55...+125°C; Power: 0.125W

## Sheet TempSensor.SchDoc
size 420 x 297 mm
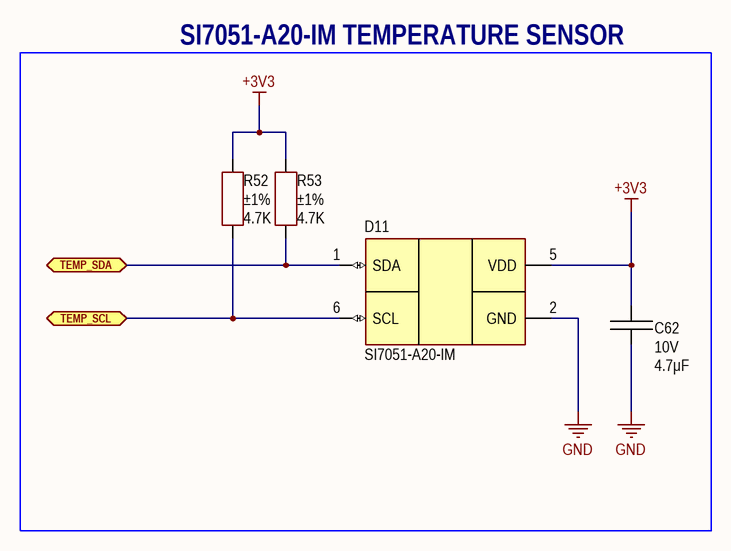
[diagram p7: TempSensor.SchDoc]

### Parts
C62  value 4.7μF  Voltage: 10V  [CAP: 0805]
D11  (no value)  [6-WDFN(3x3)]
R52  value 4.7K  Tolerance: ±1%  [RES: 0805]
R53  value 4.7K  Tolerance: ±1%  [RES: 0805]

### Blocks framed on the sheet
SI7051-A20-IM TEMPERATURE SENSOR: C62 D11 R52 R53

### Ports
TEMP_SCL (bidir), TEMP_SDA (bidir)

### Nets
+3V3: C62.2 D11.5(VDD) R52.1 R53.1
GND: C62.1 D11.2(GND)
NetD7_E3: D11.6(SCL) R52.2 ; port TEMP_SCL
NetD7_G1: D11.1(SDA) R53.2 ; port TEMP_SDA

### Notes on the sheet
- Author
- Manufacturer
- Date
- Page
- Total pages
- Size page
- A3
- Materials

### Library data of the parts
C62 = Ceramic_0805: 4.7 µF ±10% 16V Ceramic Capacitor X7R 0805 (2012 Metric); Manufacturer: Yageo; PartNumber: CC0805KKX7R7BB475; ValueManufacturerPartNumber: Ceramic capacitor, 4.7μF, X7R, ±10%, 10V, 0805, -55...+125°C; Package: 0805; HelpURL: https://www.digikey.com/en/products/detail/yageo/CC0805KKX7R7BB475/5195289; Temperature: -55...+125°C; TypeCapacitor: Ceramic capacitor; Tolerance: ±10%; TypeDielectric: X7R
D11 = SI7051-A20-IM: Temperature sensor; Manufacturer: Silicon Labs; Supply: 1.9...3.6V; Accuracy: ±0.1°C; Sensing: Digital sensor; HelpURL: https://www.digikey.com/en/products/detail/silicon-labs/SI7051-A20-IM/5882974; Package: 6-WDFN; ComponentType: IC temperature sensor; ValueManufacturerPartNumber: =ComponentType+', '+Sensing+', '+Accuracy+', '+GainBandwidth+', '+Sensitivity+', '+Temperature+', '+Package; Temperature: -40...+125°C; PartNumber: SI7051-A20-IM
R52 R53 = Resistor_0805: 4.7 kOhms ±5% 0.125W, 1/8W Chip Resistor 0805 (2012 Metric) Moisture Resistant Thick Film; Manufacturer: Yageo; PartNumber: RC0805JR-074K7L; ValueManufacturerPartNumber: Resistor film, 4.7K, ±1%, 0805, 0.125W, -55...+125°C; TypeResistor: Resistor film; Package: 0805; HelpURL: https://www.digikey.com/en/products/detail/yageo/RC0805JR-074K7L/728327; Temperature: -55...+125°C; Power: 0.125W

## Sheet SpO_Sensor.SchDoc
size 420 x 297 mm
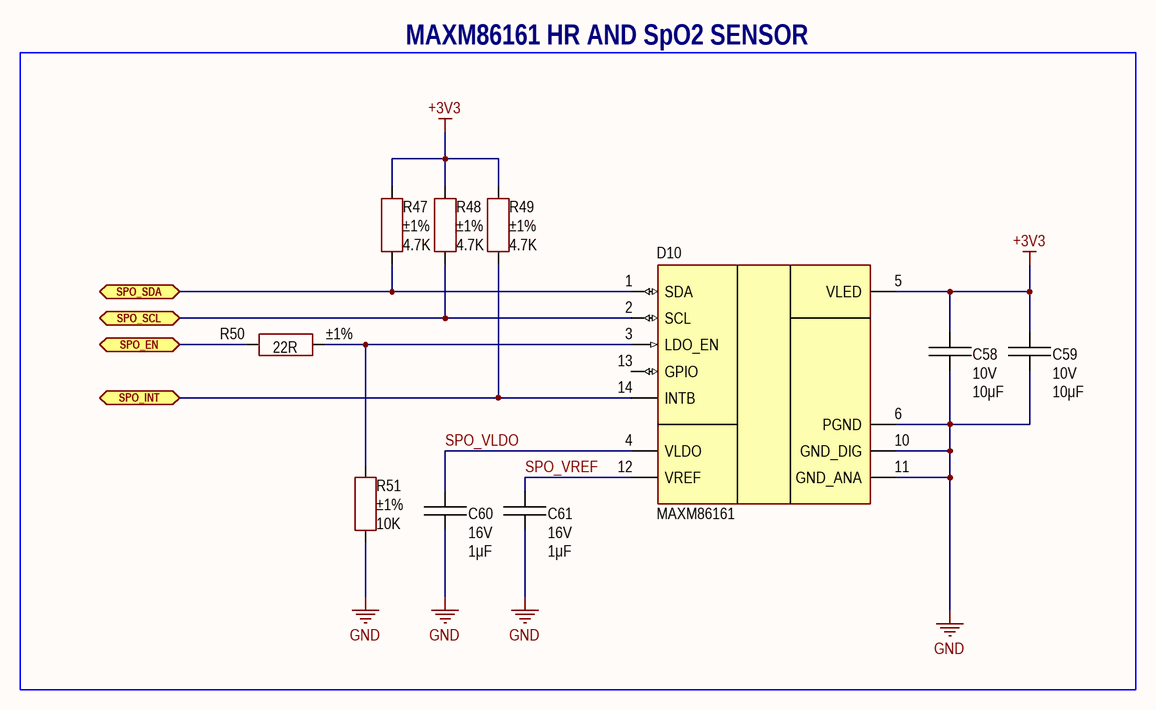
[diagram p8: SpO_Sensor.SchDoc]

### Parts
C58  value 10μF  Voltage: 10V  [CAP: 0805]
C59  value 10μF  Voltage: 10V  [CAP: 0805]
C60  value 1μF  Voltage: 16V  [CAP: 0805]
C61  value 1μF  Voltage: 16V  [CAP: 0805]
D10  (no value)  [IC: 14-OLGA]
R47  value 4.7K  Tolerance: ±1%  [RES: 0805]
R48  value 4.7K  Tolerance: ±1%  [RES: 0805]
R49  value 4.7K  Tolerance: ±1%  [RES: 0805]
R50  value 22R  Tolerance: ±1%  [RES: 0805]
R51  value 10K  Tolerance: ±1%  [RES: 0805]

### Blocks framed on the sheet
MAXM86161 HR AND SpO2 SENSOR: C58-C61 D10 R47-R51

### Ports
SPO_EN (bidir), SPO_INT (bidir), SPO_SCL (bidir), SPO_SDA (bidir)

### Nets
+3V3: C58.2 C59.2 D10.5(VLED) R47.1 R48.1 R49.1
GND: C58.1 C59.1 C60.1 C61.1 D10.6(PGND) D10.10(GND_DIG) D10.11(GND_ANA) R51.2
SPO_VLDO: C60.2 D10.4(VLDO)
SPO_VREF: C61.2 D10.12(VREF)
NetD7_J4: D10.2(SCL) R48.2 ; port SPO_SCL
NetD7_J5: D10.1(SDA) R47.2 ; port SPO_SDA
NetD7_K2: D10.14(INTB) R49.2 ; port SPO_INT
NetD7_K3: R50.1 ; port SPO_EN
NetD10_3: D10.3(LDO_EN) R50.2 R51.1

Not connected (* = marked no-connect by the designer): D10 13(GPIO)

### Notes on the sheet
- Author
- Manufacturer
- Date
- Page
- Total pages
- Size page
- A3
- Materials

### Library data of the parts
C58 C59 = Ceramic_0805: as C34 on sheet MCU; Package: 0805; HelpURL: https://www.digikey.com/en/products/detail/yageo/CC0805KFX7R6BB106/11611326; Temperature: -55...+125°C; TypeCapacitor: Ceramic capacitor; Tolerance: ±10%; TypeDielectric: X7R
C60 C61 = Ceramic_0805: 1 µF ±10% 16V Ceramic Capacitor X7R 0805 (2012 Metric); Manufacturer: Yageo; PartNumber: CC0805KKX7R7BB105; ValueManufacturerPartNumber: Ceramic capacitor, 1μF, X7R, ±10%, 16V, 0805, -55...+125°C; Package: 0805; HelpURL: https://www.digikey.com/en/products/detail/yageo/CC0805KKX7R7BB105/2103103; Temperature: -55...+125°C; TypeCapacitor: Ceramic capacitor; Tolerance: ±10%; TypeDielectric: X7R
D10 = MAXM86161: HR and SpO2 sensor; Manufacturer: Maxim Integrated; Supply: 3.0...3.3V; HelpURL: https://www.digikey.com/en/products/detail/maxim-integrated/MAXM86161EFD/10258730; Package: 14-OLGA; ComponentType: IC HR and SpO2 sensor; ValueManufacturerPartNumber: =ComponentType+', '+Sensing+', '+Accuracy+', '+GainBandwidth+', '+Sensitivity+', '+Temperature+', '+Package; Temperature: -40°C..+85°C; Sensing: HR and SpO2 sensor; PartNumber: MAXM86161
R47-R49 = Resistor_0805: as R52 on sheet TempSensor; Package: 0805; HelpURL: https://www.digikey.com/en/products/detail/yageo/RC0805JR-074K7L/728327; Temperature: -55...+125°C; Power: 0.125W
R50 = Resistor_0805: as R31 on sheet MCU; Package: 0805; HelpURL: https://www.digikey.com/en/products/detail/yageo/RC0805FR-0722RL/727735; Temperature: -55...+125°C; Power: 0.125W
R51 = Resistor_0805: as R7 on sheet Accelerometer; Package: 0805; HelpURL: https://www.digikey.com/en/products/detail/yageo/RC0805FR-0710KL/727535; Temperature: -55...+125°C; Power: 0.125W